# Altium project v2.1.PrjPCB
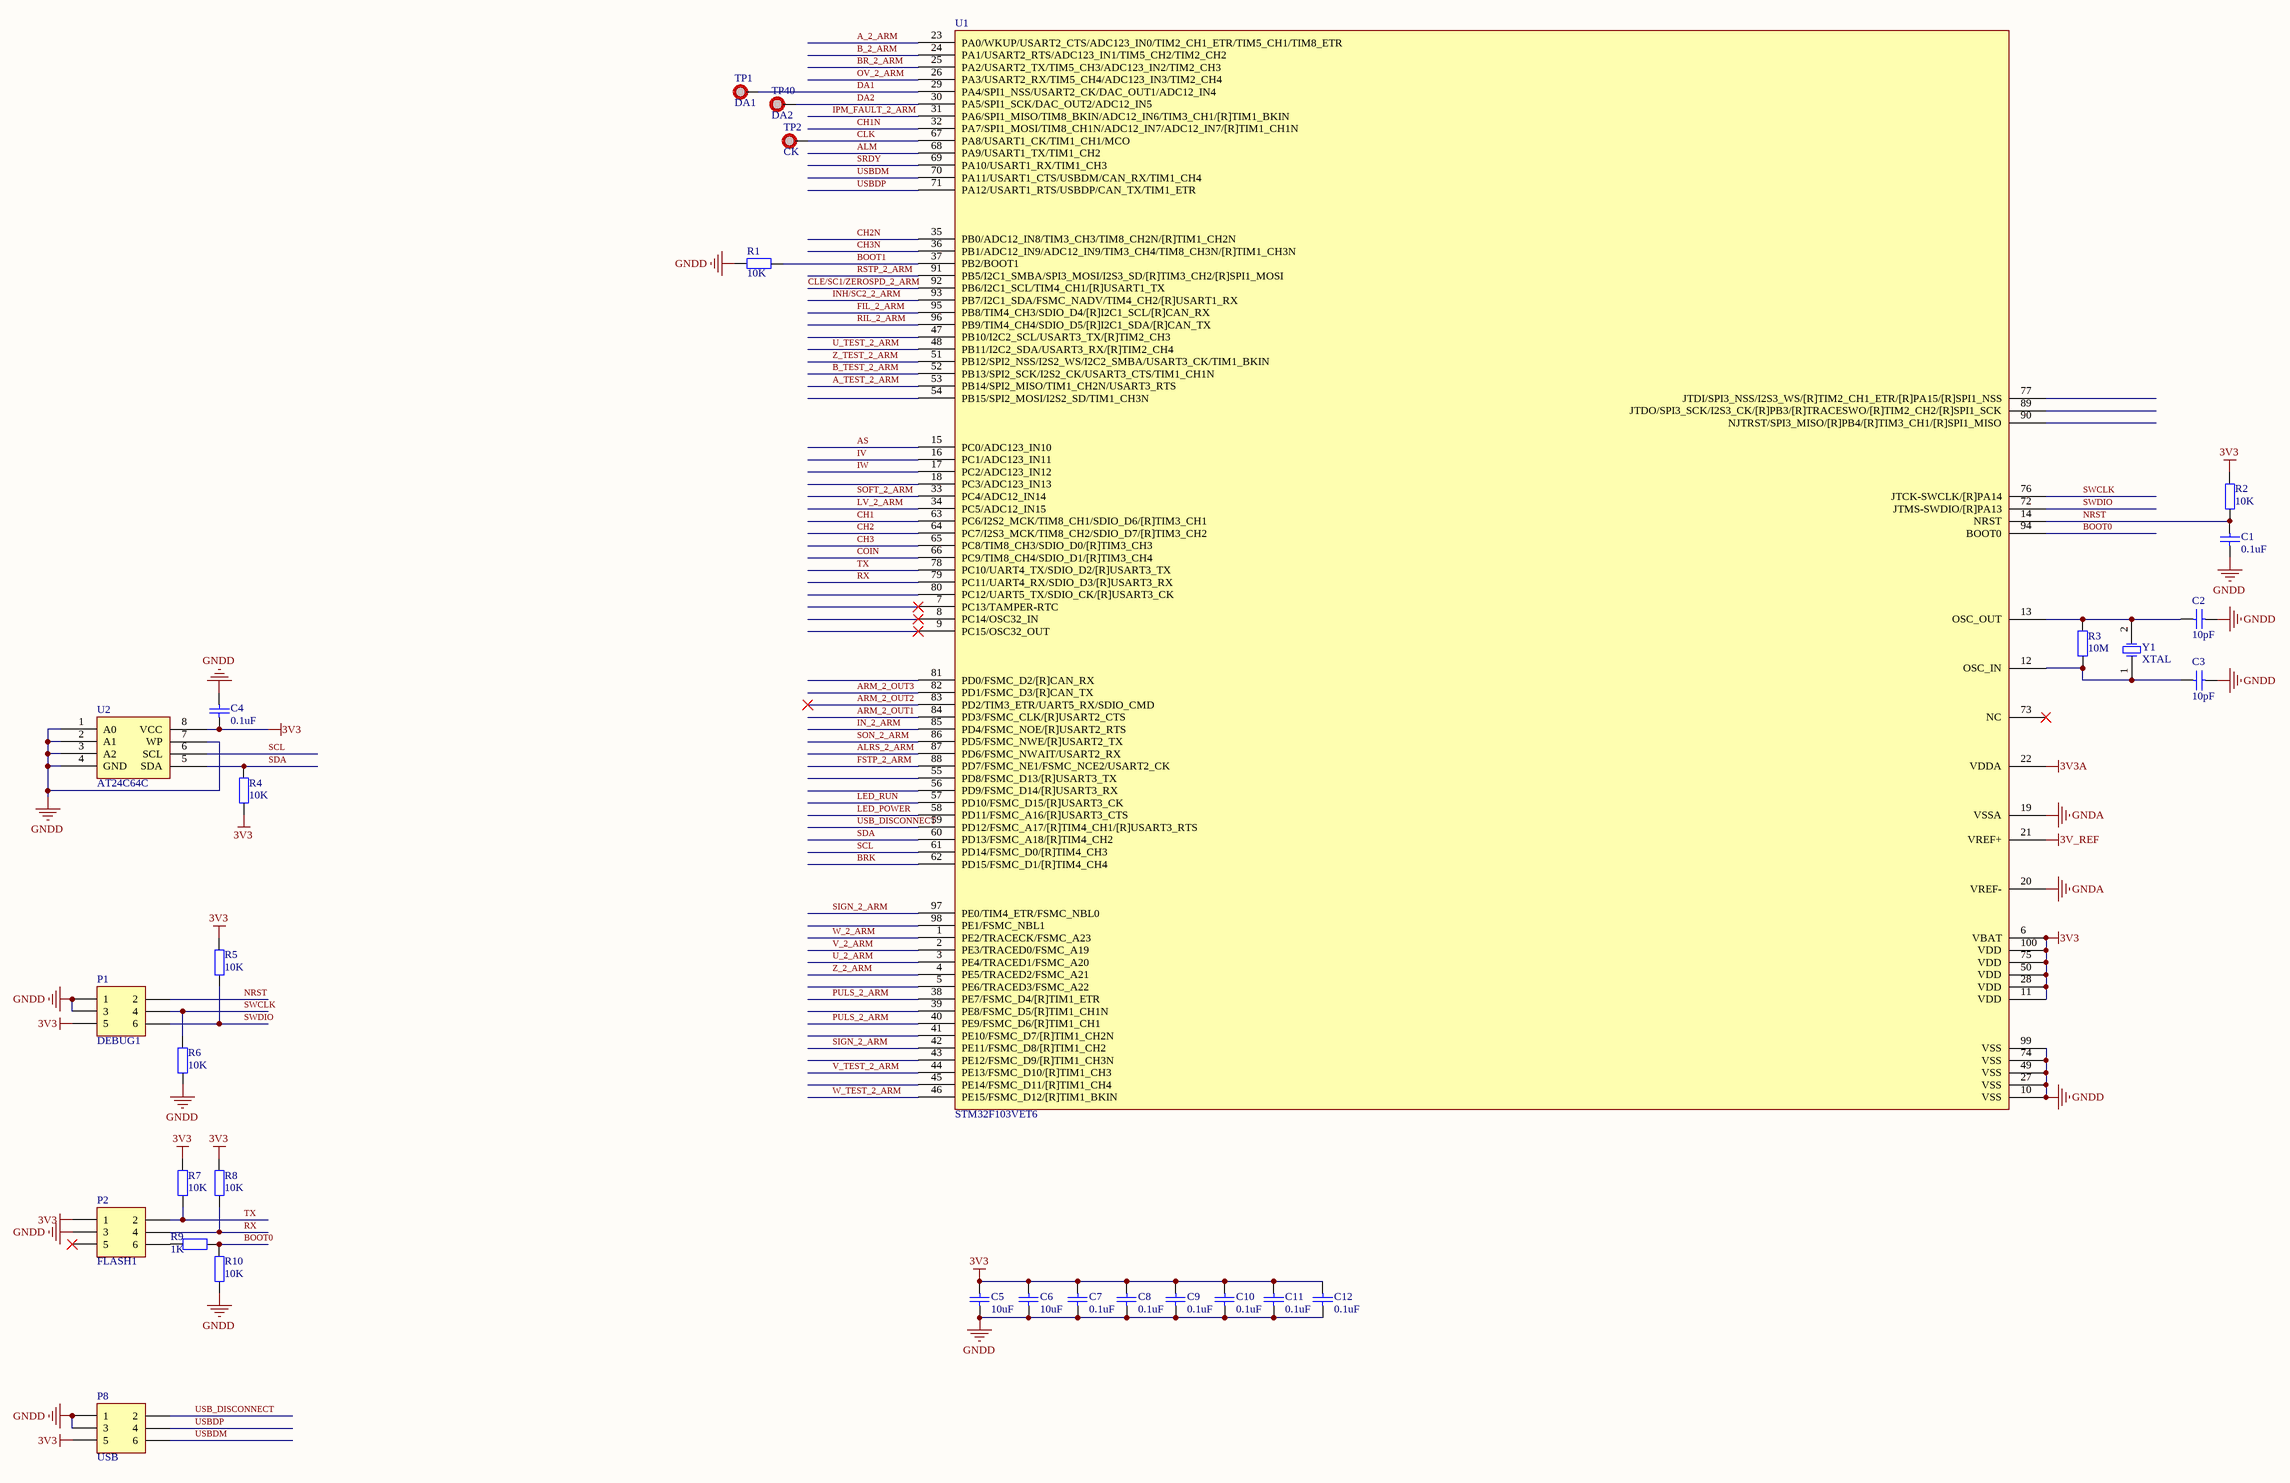
[diagram p0: MCU.SchDoc]
6 sheets, 388 parts. Net scope: global (net labels, ports and power ports of the same name join across sheets).
Board file: V2.1.PcbDoc
Sheets:
  MCU.SchDoc
  调理电路.SchDoc
  指令.SchDoc
  编码器.SchDoc
  接口.SchDoc
  电源.SchDoc

## Sheet MCU.SchDoc
size A2

### Parts
C1  0.1uF  [C SMD 0603]
C2  10pF  [C SMD 0603]
C3  10pF  [C SMD 0603]
C4  0.1uF  [C SMD 0603]
C5  10uF  [C SMD 1206]
C6  10uF  [C SMD 1206]
C7  0.1uF  [C SMD 0603]
C8  0.1uF  [C SMD 0603]
C9  0.1uF  [C SMD 0603]
C10  0.1uF  [C SMD 0603]
C11  0.1uF  [C SMD 0603]
C12  0.1uF  [C SMD 0603]
P1  DEBUG1  [2.54 针 3*2]
P2  FLASH1  [2.54 针 3*2]
P8  USB  [2.54 针 3*2]
R1  10K  [R SMD 0603]
R2  10K  [R SMD 0603]
R3  10M  [R SMD 0603]
R4  10K  [R SMD 0603]
R5  10K  [R SMD 0603]
R6  10K  [R SMD 0603]
R7  10K  [R SMD 0603]
R8  10K  [R SMD 0603]
R9  1K  [R SMD 0603]
R10  10K  [R SMD 0603]
TP1  DA1  [测点]
TP2  CK  [测点]
TP40  DA2  [测点]
U1  STM32F103VET6  [LQFP100_L]
U2  AT24C64C  [TSSOP8]
Y1  XTAL  [XTAL]

### Nets
3V3: C4.2 C5.1 C6.1 C7.1 C8.1 C9.1 C10.1 C11.1 C12.1 P1.5 P2.1 P8.5 R2.2 R4.2 R5.2 R7.2 R8.2 U1.6(VBAT) U1.11(VDD) U1.28(VDD) U1.50(VDD) U1.75(VDD) U1.100(VDD) U2.8(VCC)
3V3A: U1.22(VDDA)
3V_REF: U1.21(VREF+)
GNDA: U1.19(VSSA) U1.20(VREF-)
GNDD: C1.2 C2.2 C3.2 C4.1 C5.2 C6.2 C7.2 C8.2 C9.2 C10.2 C11.2 C12.2 P1.1 P1.3 P2.3 P8.1 P8.3 R1.2 R6.1 R10.2 U1.10(VSS) U1.27(VSS) U1.49(VSS) U1.74(VSS) U1.99(VSS) U2.1(A0) U2.2(A1) U2.3(A2) U2.4(GND) U2.7(WP)
A_2_ARM: U1.23(PA0/WKUP/USART2_CTS/ADC123_IN0/TIM2_CH1_ETR/TIM5_CH1/TIM8_ETR)
A_TEST_2_ARM: U1.53(PB14/SPI2_MISO/TIM1_CH2N/USART3_RTS)
ALM: U1.68(PA9/USART1_TX/TIM1_CH2)
ALRS_2_ARM: U1.87(PD6/FSMC_NWAIT/USART2_RX)
ARM_2_OUT1: U1.84(PD3/FSMC_CLK/[R]USART2_CTS)
ARM_2_OUT2: U1.83(PD2/TIM3_ETR/UART5_RX/SDIO_CMD)
ARM_2_OUT3: U1.82(PD1/FSMC_D3/[R]CAN_TX)
AS: U1.15(PC0/ADC123_IN10)
B_2_ARM: U1.24(PA1/USART2_RTS/ADC123_IN1/TIM5_CH2/TIM2_CH2)
B_TEST_2_ARM: U1.52(PB13/SPI2_SCK/I2S2_CK/USART3_CTS/TIM1_CH1N)
BOOT0: R9.1 R10.1 U1.94(BOOT0)
BOOT1: R1.1 U1.37(PB2/BOOT1)
BR_2_ARM: U1.25(PA2/USART2_TX/TIM5_CH3/ADC123_IN2/TIM2_CH3)
BRK: U1.62(PD15/FSMC_D1/[R]TIM4_CH4)
CH1: U1.63(PC6/I2S2_MCK/TIM8_CH1/SDIO_D6/[R]TIM3_CH1)
CH1N: U1.32(PA7/SPI1_MOSI/TIM8_CH1N/ADC12_IN7/ADC12_IN7/[R]TIM1_CH1N)
CH2: U1.64(PC7/I2S3_MCK/TIM8_CH2/SDIO_D7/[R]TIM3_CH2)
CH2N: U1.35(PB0/ADC12_IN8/TIM3_CH3/TIM8_CH2N/[R]TIM1_CH2N)
CH3: U1.65(PC8/TIM8_CH3/SDIO_D0/[R]TIM3_CH3)
CH3N: U1.36(PB1/ADC12_IN9/ADC12_IN9/TIM3_CH4/TIM8_CH3N/[R]TIM1_CH3N)
CLE/SC1/ZEROSPD_2_ARM: U1.92(PB6/I2C1_SCL/TIM4_CH1/[R]USART1_TX)
CLK: TP2.1 U1.67(PA8/USART1_CK/TIM1_CH1/MCO)
COIN: U1.66(PC9/TIM8_CH4/SDIO_D1/[R]TIM3_CH4)
DA1: TP1.1 U1.29(PA4/SPI1_NSS/USART2_CK/DAC_OUT1/ADC12_IN4)
DA2: TP40.1 U1.30(PA5/SPI1_SCK/DAC_OUT2/ADC12_IN5)
FIL_2_ARM: U1.95(PB8/TIM4_CH3/SDIO_D4/[R]I2C1_SCL/[R]CAN_RX)
FSTP_2_ARM: U1.88(PD7/FSMC_NE1/FSMC_NCE2/USART2_CK)
IN_2_ARM: U1.85(PD4/FSMC_NOE/[R]USART2_RTS)
INH/SC2_2_ARM: U1.93(PB7/I2C1_SDA/FSMC_NADV/TIM4_CH2/[R]USART1_RX)
IPM_FAULT_2_ARM: U1.31(PA6/SPI1_MISO/TIM8_BKIN/ADC12_IN6/TIM3_CH1/[R]TIM1_BKIN)
IV: U1.16(PC1/ADC123_IN11)
IW: U1.17(PC2/ADC123_IN12)
LED_POWER: U1.58(PD11/FSMC_A16/[R]USART3_CTS)
LED_RUN: U1.57(PD10/FSMC_D15/[R]USART3_CK)
LV_2_ARM: U1.34(PC5/ADC12_IN15)
NRST: C1.1 P1.2 R2.1 U1.14(NRST)
OV_2_ARM: U1.26(PA3/USART2_RX/TIM5_CH4/ADC123_IN3/TIM2_CH4)
PULS_2_ARM: U1.38(PE7/FSMC_D4/[R]TIM1_ETR) U1.40(PE9/FSMC_D6/[R]TIM1_CH1)
RIL_2_ARM: U1.96(PB9/TIM4_CH4/SDIO_D5/[R]I2C1_SDA/[R]CAN_TX)
RSTP_2_ARM: U1.91(PB5/I2C1_SMBA/SPI3_MOSI/I2S3_SD/[R]TIM3_CH2/[R]SPI1_MOSI)
RX: P2.4 R8.1 U1.79(PC11/UART4_RX/SDIO_D3/[R]USART3_RX)
SCL: U1.61(PD14/FSMC_D0/[R]TIM4_CH3) U2.6(SCL)
SDA: R4.1 U1.60(PD13/FSMC_A18/[R]TIM4_CH2) U2.5(SDA)
SIGN_2_ARM: U1.42(PE11/FSMC_D8/[R]TIM1_CH2) U1.97(PE0/TIM4_ETR/FSMC_NBL0)
SOFT_2_ARM: U1.33(PC4/ADC12_IN14)
SON_2_ARM: U1.86(PD5/FSMC_NWE/[R]USART2_TX)
SRDY: U1.69(PA10/USART1_RX/TIM1_CH3)
SWCLK: P1.4 R6.2 U1.76(JTCK-SWCLK/[R]PA14)
SWDIO: P1.6 R5.1 U1.72(JTMS-SWDIO/[R]PA13)
TX: P2.2 R7.1 U1.78(PC10/UART4_TX/SDIO_D2/[R]USART3_TX)
U_2_ARM: U1.3(PE4/TRACED1/FSMC_A20)
U_TEST_2_ARM: U1.48(PB11/I2C2_SDA/USART3_RX/[R]TIM2_CH4)
USB_DISCONNECT: P8.2 U1.59(PD12/FSMC_A17/[R]TIM4_CH1/[R]USART3_RTS)
USBDM: P8.6 U1.70(PA11/USART1_CTS/USBDM/CAN_RX/TIM1_CH4)
USBDP: P8.4 U1.71(PA12/USART1_RTS/USBDP/CAN_TX/TIM1_ETR)
V_2_ARM: U1.2(PE3/TRACED0/FSMC_A19)
V_TEST_2_ARM: U1.44(PE13/FSMC_D10/[R]TIM1_CH3)
W_2_ARM: U1.1(PE2/TRACECK/FSMC_A23)
W_TEST_2_ARM: U1.46(PE15/FSMC_D12/[R]TIM1_BKIN)
Z_2_ARM: U1.4(PE5/TRACED2/FSMC_A21)
Z_TEST_2_ARM: U1.51(PB12/SPI2_NSS/I2S2_WS/I2C2_SMBA/USART3_CK/TIM1_BKIN)
NetC2_1: C2.1 R3.1 U1.13(OSC_OUT) Y1.2(OSC2)
NetC3_1: C3.1 R3.2 U1.12(OSC_IN) Y1.1(OSC1)
NetP2_6: P2.6 R9.2

Not connected (* = marked no-connect by the designer): P2 5*; U1 5(PE6/TRACED3/FSMC_A22) 7(PC13/TAMPER-RTC)* 8(PC14/OSC32_IN)* 9(PC15/OSC32_OUT)* 18(PC3/ADC123_IN13) 39(PE8/FSMC_D5/[R]TIM1_CH1N) 41(PE10/FSMC_D7/[R]TIM1_CH2N) 43(PE12/FSMC_D9/[R]TIM1_CH3N) 45(PE14/FSMC_D11/[R]TIM1_CH4) 47(PB10/I2C2_SCL/USART3_TX/[R]TIM2_CH3) 54(PB15/SPI2_MOSI/I2S2_SD/TIM1_CH3N) 55(PD8/FSMC_D13/[R]USART3_TX) 56(PD9/FSMC_D14/[R]USART3_RX) 73(NC)* 77(JTDI/SPI3_NSS/I2S3_WS/[R]TIM2_CH1_ETR/[R]PA15/[R]SPI1_NSS) 80(PC12/UART5_TX/SDIO_CK/[R]USART3_CK) 81(PD0/FSMC_D2/[R]CAN_RX) 89(JTDO/SPI3_SCK/I2S3_CK/[R]PB3/[R]TRACESWO/[R]TIM2_CH2/[R]SPI1_SCK) 90(NJTRST/SPI3_MISO/[R]PB4/[R]TIM3_CH1/[R]SPI1_MISO) 98(PE1/FSMC_NBL1)

### Library data of the parts
C1 C4 C7-C12 = Cap: Capacitor; Published: 8-Jun-2000; LatestRevisionDate: 17-Jul-2002; LatestRevisionNote: Re-released for DXP Platform.; PackageReference: RAD-0.3; Publisher: Altium Limited; Value: 0.1uF
  C1 C7-C12: PackageDescription: Radial Cap, Thru-Hole; 2 Leads; 0.3 in Pin Spacing
C2 C3 C5 C6 = Cap: Capacitor; Value: 0.1uF; Published: 8-Jun-2000; LatestRevisionDate: 17-Jul-2002; LatestRevisionNote: Re-released for DXP Platform.; PackageReference: RAD-0.3; Publisher: Altium Limited; PackageDescription: Radial Cap, Thru-Hole; 2 Leads; 0.3 in Pin Spacing
P1 P2 P8 = Header 3X2: Header, 3-Pin, Dual row; LatestRevisionDate: 17-Jul-2002; LatestRevisionNote: Re-released for DXP Platform.; Publisher: Altium Limited
R1-R3 R5-R10 = Res2: Resistor; Value: 1M; Published: 8-Jun-2000; LatestRevisionDate: 17-Jul-2002; LatestRevisionNote: Re-released for DXP Platform.; PackageReference: AXIAL-0.4; Publisher: Altium Limited
R4 = Res2: Resistor; Published: 8-Jun-2000; LatestRevisionDate: 17-Jul-2002; LatestRevisionNote: Re-released for DXP Platform.; PackageReference: AXIAL-0.4; Publisher: Altium Limited; Value: 10K
TP1 TP2 TP40 = TEST_POINT
Y1 = XTAL: Crystal Oscillator; Published: 8-Jun-2000; LatestRevisionDate: 17-Jul-2002; LatestRevisionNote: Re-released for DXP Platform.; PackageReference: R38; Publisher: Altium Limited

## Sheet 调理电路.SchDoc
size A4 portrait
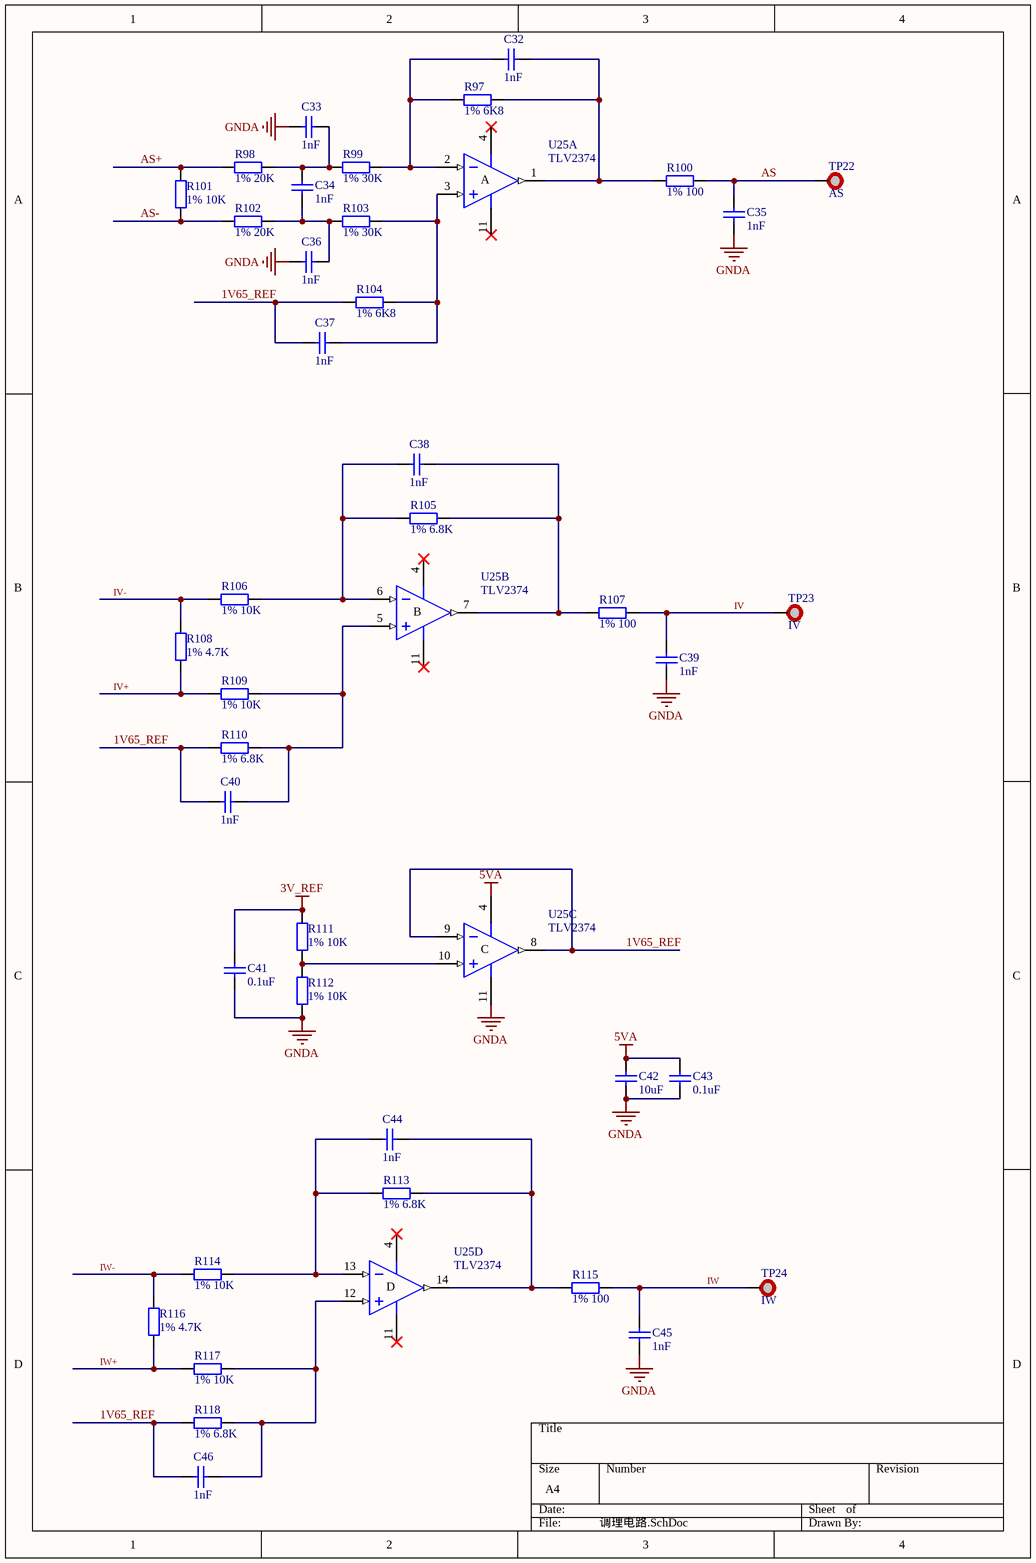
[diagram p1: 调理电路.SchDoc]

### Parts
C32  1nF  [C SMD 0603]
C33  1nF  [C SMD 0603]
C34  1nF  [C SMD 0603]
C35  1nF  [C SMD 0603]
C36  1nF  [C SMD 0603]
C37  1nF  [C SMD 0603]
C38  1nF  [C SMD 0603]
C39  1nF  [C SMD 0603]
C40  1nF  [C SMD 0603]
C41  0.1uF  [C SMD 0603]
C42  10uF  [C SMD 1206]
C43  0.1uF  [C SMD 0603]
C44  1nF  [C SMD 0603]
C45  1nF  [C SMD 0603]
C46  1nF  [C SMD 0603]
R97  1% 6K8  [R SMD 0603 1%]
R98  1% 20K  [R SMD 0603 1%]
R99  1% 30K  [R SMD 0603 1%]
R100  1% 100  [R SMD 0603 1%]
R101  1% 10K  [R SMD 0603 1%]
R102  1% 20K  [R SMD 0603 1%]
R103  1% 30K  [R SMD 0603 1%]
R104  1% 6K8  [R SMD 0603 1%]
R105  1% 6.8K  [R SMD 0603 1%]
R106  1% 10K  [R SMD 0603 1%]
R107  1% 100  [R SMD 0603 1%]
R108  1% 4.7K  [R SMD 0603 1%]
R109  1% 10K  [R SMD 0603 1%]
R110  1% 6.8K  [R SMD 0603 1%]
R111  1% 10K  [R SMD 0603 1%]
R112  1% 10K  [R SMD 0603 1%]
R113  1% 6.8K  [R SMD 0603 1%]
R114  1% 10K  [R SMD 0603 1%]
R115  1% 100  [R SMD 0603 1%]
R116  1% 4.7K  [R SMD 0603 1%]
R117  1% 10K  [R SMD 0603 1%]
R118  1% 6.8K  [R SMD 0603 1%]
TP22  AS  [测点]
TP23  IV  [测点]
TP24  IW  [测点]
U25  TLV2374  [NSO14_N]  (parts A,B,C,D of 4)

### Nets
3V_REF: C41.2 R111.2
5VA: C42.2 C43.2 U25.4(V+)
GNDA: C33.1 C35.1 C36.1 C39.1 C41.1 C42.1 C43.1 C45.1 R112.1 U25.11(V-)
1V65_REF: C37.1 C40.1 C46.1 R104.1 R110.2 R118.2 U25.8(OUT) U25.9(IN-)
AS: C35.2 R100.2 TP22.1
AS+: R98.1 R101.1
AS-: R101.2 R102.1
IV: C39.2 R107.2 TP23.1
IV+: R108.2 R109.2
IV-: R106.2 R108.1
IW: C45.2 R115.2 TP24.1
IW+: R116.2 R117.2
IW-: R114.2 R116.1
NetC32_1: C32.1 R97.1 R99.2 U25.2(IN-)
NetC32_2: C32.2 R97.2 R100.1 U25.1(OUT)
NetC33_2: C33.2 C34.1 R98.2 R99.1
NetC34_2: C34.2 C36.2 R102.2 R103.1
NetC37_2: C37.2 R103.2 R104.2 U25.3(IN+)
NetC38_1: C38.1 R105.2 R106.1 U25.6(IN-)
NetC38_2: C38.2 R105.1 R107.1 U25.7(OUT)
NetC40_2: C40.2 R109.1 R110.1 U25.5(IN+)
NetC44_1: C44.1 R113.2 R114.1 U25.13(IN-)
NetC44_2: C44.2 R113.1 R115.1 U25.14(OUT)
NetC46_2: C46.2 R117.1 R118.1 U25.12(IN+)
NetR111_1: R111.1 R112.2 U25.10(IN+)

### Notes on the sheet
- (in symbol OPA4130PA, part A) A
- (in symbol OPA4130PA, part B) B
- (in symbol OPA4130PA, part C) C
- (in symbol OPA4130PA, part D) D

### Library data of the parts
C32-C40 C44-C46 = Cap: Capacitor; Value: 0.1uF; Published: 8-Jun-2000; LatestRevisionDate: 17-Jul-2002; LatestRevisionNote: Re-released for DXP Platform.; PackageReference: RAD-0.3; Publisher: Altium Limited; PackageDescription: Radial Cap, Thru-Hole; 2 Leads; 0.3 in Pin Spacing
C41-C43 = Cap: Capacitor; Value: 104; Published: 8-Jun-2000; LatestRevisionDate: 17-Jul-2002; LatestRevisionNote: Re-released for DXP Platform.; PackageReference: RAD-0.3; Publisher: Altium Limited
R97-R118 = Res2: Resistor; Value: 1K; Published: 8-Jun-2000; LatestRevisionDate: 17-Jul-2002; LatestRevisionNote: Re-released for DXP Platform.; PackageReference: AXIAL-0.4; Publisher: Altium Limited
TP22-TP24 = TEST_POINT
U25 = OPA4130PA: Low-Power, Precision FET-Input Operational Amplifiers; Published: 8-Jun-2000; LatestRevisionDate: 06-Jun-2005; LatestRevisionNote: Stylized 3D Model Added.; DatasheetVersion: May-1998; PackageVersion: 1996/1997; PackageReference: 010G; Publisher: Altium Limited; PackageDescription: DIP; 14 Leads; Row Spacing 7.62 mm; Pitch 2.54 mm; ComponentLink1Description: Manufacturer Link; ComponentLink1URL: http://www.ti.com/; ComponentLink2Description: Datasheet; ComponentLink2URL: http://www-s.ti.com/sc/ds/OPA130.pdf

## Sheet 指令.SchDoc
size A1 portrait
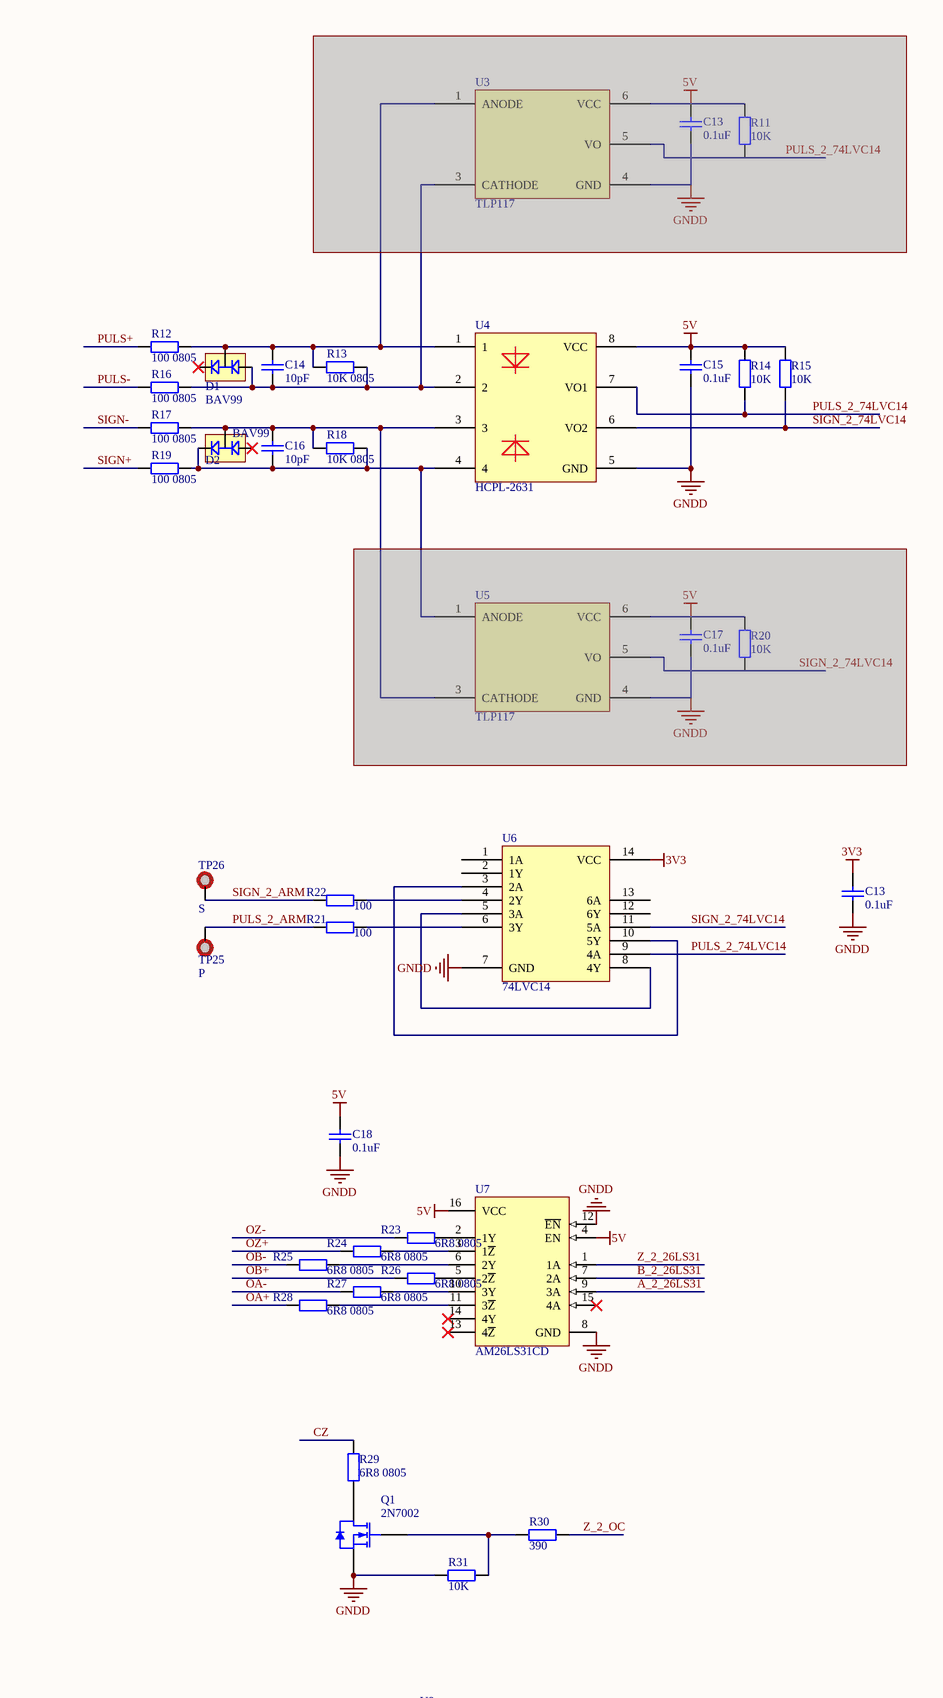
[diagram p2: 指令.SchDoc, top]
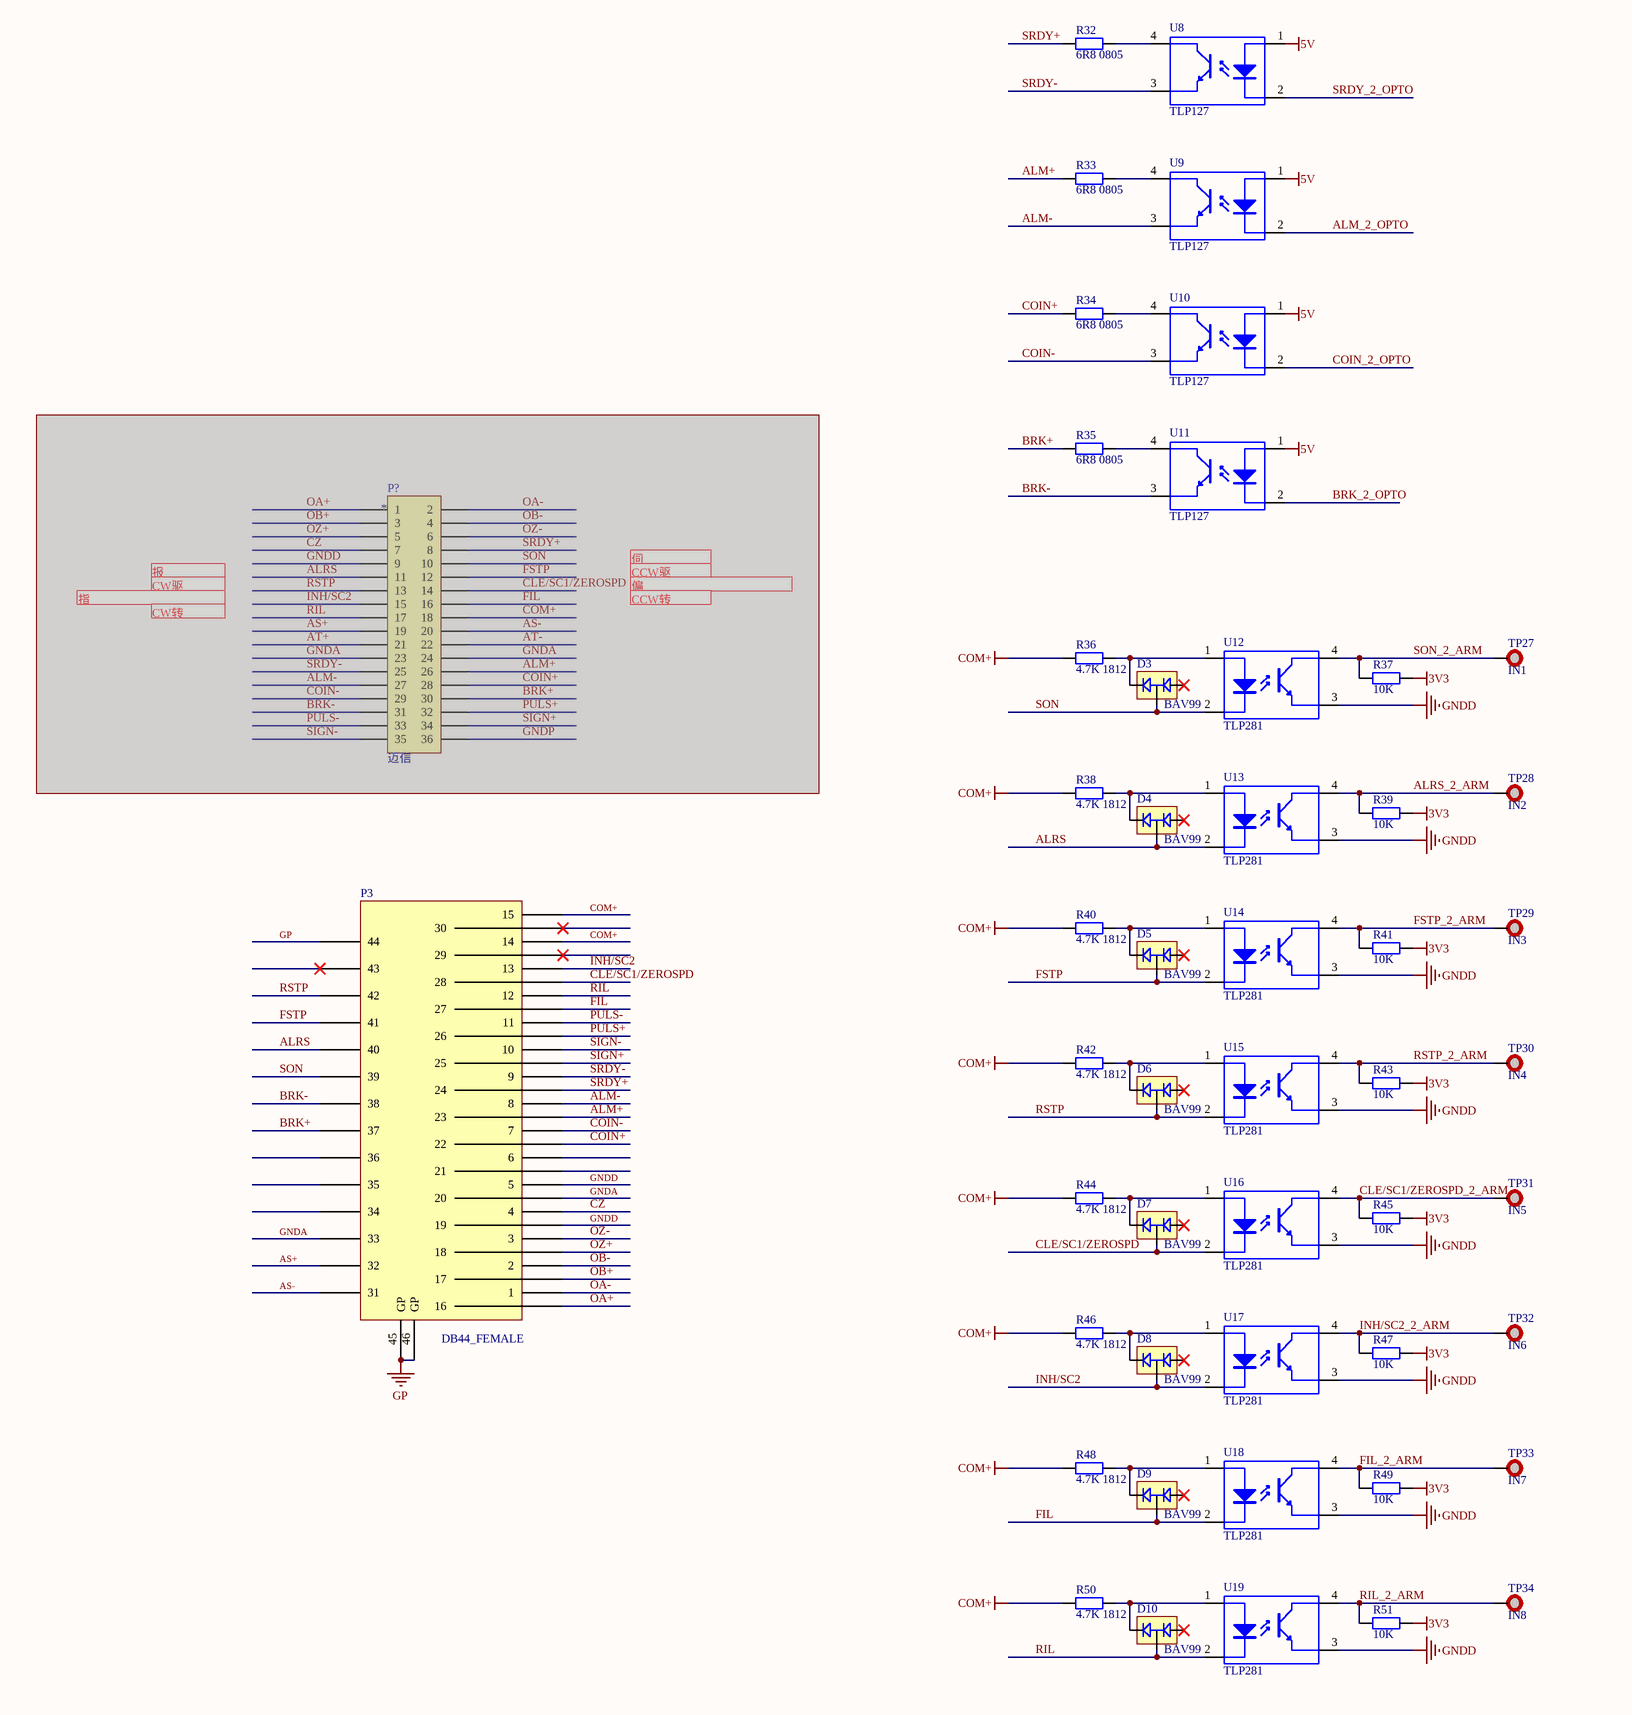
[diagram p3: 指令.SchDoc, bottom]

### Parts
(Parts that share a designator on the sheet are numbered #1, #2 ... from top to bottom, then left to right.)
C13#1  0.1uF  [C SMD 0603]  (masked out: inside a compile mask, not in the netlist)
C13#2  0.1uF  [C SMD 0603]
C14  10pF  [C SMD 0603]
C15  0.1uF  [C SMD 0603]
C16  10pF  [C SMD 0603]
C17#1  0.1uF  [C SMD 0603]  (masked out: inside a compile mask, not in the netlist)
C18  0.1uF  [C SMD 0603]
D1  BAV99  [SOT23]
D2  BAV99  [SOT23]
D3  BAV99  [SOT23]
D4  BAV99  [SOT23]
D5  BAV99  [SOT23]
D6  BAV99  [SOT23]
D7  BAV99  [SOT23]
D8  BAV99  [SOT23]
D9  BAV99  [SOT23]
D10  BAV99  [SOT23]
P3  DB44_FEMALE
P?#1  *  [AMP36_小孔小焊盘]  (masked out: inside a compile mask, not in the netlist)
Q1  2N7002  [SOT23]
R11#1  10K  [R SMD 0603]  (masked out: inside a compile mask, not in the netlist)
R12  100 0805  [R SMD 0805]
R13  10K 0805  [R SMD 0805]
R14  10K  [R SMD 0603]
R15  10K  [R SMD 0603]
R16  100 0805  [R SMD 0805]
R17  100 0805  [R SMD 0805]
R18  10K 0805  [R SMD 0805]
R19  100 0805  [R SMD 0805]
R20#1  10K  [R SMD 0603]  (masked out: inside a compile mask, not in the netlist)
R21  100  [R SMD 0603]
R22  100  [R SMD 0603]
R23  6R8 0805  [R SMD 0805]
R24  6R8 0805  [R SMD 0805]
R25  6R8 0805  [R SMD 0805]
R26  6R8 0805  [R SMD 0805]
R27  6R8 0805  [R SMD 0805]
R28  6R8 0805  [R SMD 0805]
R29  6R8 0805  [R SMD 0805]
R30  390  [R SMD 0603]
R31  10K  [R SMD 0603]
R32  6R8 0805  [R SMD 0805]
R33  6R8 0805  [R SMD 0805]
R34  6R8 0805  [R SMD 0805]
R35  6R8 0805  [R SMD 0805]
R36  4.7K 1812  [R SMD 1812]
R37  10K  [R SMD 0603]
R38  4.7K 1812  [R SMD 1812]
R39  10K  [R SMD 0603]
R40  4.7K 1812  [R SMD 1812]
R41  10K  [R SMD 0603]
R42  4.7K 1812  [R SMD 1812]
R43  10K  [R SMD 0603]
R44  4.7K 1812  [R SMD 1812]
R45  10K  [R SMD 0603]
R46  4.7K 1812  [R SMD 1812]
R47  10K  [R SMD 0603]
R48  4.7K 1812  [R SMD 1812]
R49  10K  [R SMD 0603]
R50  4.7K 1812  [R SMD 1812]
R51  10K  [R SMD 0603]
TP25  P  [测点]
TP26  S  [测点]
TP27  IN1  [测点]
TP28  IN2  [测点]
TP29  IN3  [测点]
TP30  IN4  [测点]
TP31  IN5  [测点]
TP32  IN6  [测点]
TP33  IN7  [测点]
TP34  IN8  [测点]
U3#1  TLP117  [TLP117]  (masked out: inside a compile mask, not in the netlist)
U4  HCPL-2631  [HCPL062N]
U5  TLP117  [TLP117]  (masked out: inside a compile mask, not in the netlist)
U6  74LVC14  [TSSOP14]
U7  AM26LS31CD  [NSO16_N]
U8  TLP127  [TLP181]
U9  TLP127  [TLP181]
U10  TLP127  [TLP181]
U11  TLP127  [TLP181]
U12  TLP281  [TLP281]
U13  TLP281  [TLP281]
U14  TLP281  [TLP281]
U15  TLP281  [TLP281]
U16  TLP281  [TLP281]
U17  TLP281  [TLP281]
U18  TLP281  [TLP281]
U19  TLP281  [TLP281]

### Nets
3V3: C13#2.1 R37.1 R39.1 R41.1 R43.1 R45.1 R47.1 R49.1 R51.1 U6.14(VCC)
5V: C15.2 C18.1 R14.2 R15.2 U4.8(VCC) U7.4(EN) U7.16(VCC) U8.1 U9.1 U10.1 U11.1
COM+: P3.14 P3.15 R36.2 R38.2 R40.2 R42.2 R44.2 R46.2 R48.2 R50.2
GNDA: P3.20 P3.33
GNDD: C13#2.2 C15.1 C18.2 P3.5 P3.19 Q1.2(S) R31.2 U4.5(GND) U6.7(GND) U7.8(GND) U7.12(~{EN}) U12.3 U13.3 U14.3 U15.3 U16.3 U17.3 U18.3 U19.3
GP: P3.44 P3.45(GP) P3.46(GP)
A_2_26LS31: U7.9(3A)
ALM+: P3.23 R33.2
ALM-: P3.8 U9.3
ALM_2_OPTO: U9.2
ALRS: D4.3 P3.40 U13.2
ALRS_2_ARM: R39.2 TP28.1 U13.4
AS+: P3.32
AS-: P3.31
B_2_26LS31: U7.7(2A)
BRK+: P3.37 R35.2
BRK-: P3.38 U11.3
BRK_2_OPTO: U11.2
CLE/SC1/ZEROSPD: D7.3 P3.28 U16.2
CLE/SC1/ZEROSPD_2_ARM: R45.2 TP31.1 U16.4
COIN+: P3.22 R34.2
COIN-: P3.7 U10.3
COIN_2_OPTO: U10.2
CZ: P3.4 R29.1
FIL: D9.3 P3.27 U18.2
FIL_2_ARM: R49.2 TP33.1 U18.4
FSTP: D5.3 P3.41 U14.2
FSTP_2_ARM: R41.2 TP29.1 U14.4
INH/SC2: D8.3 P3.13 U17.2
INH/SC2_2_ARM: R47.2 TP32.1 U17.4
OA+: P3.16 R28.2
OA-: P3.1 R27.2
OB+: P3.17 R26.2
OB-: P3.2 R25.2
OZ+: P3.18 R24.2
OZ-: P3.3 R23.2
PULS+: P3.26 R12.2
PULS-: P3.11 R16.2
PULS_2_74LVC14: R14.1 U4.7(VO1) U6.9(4A)
PULS_2_ARM: R21.1 TP25.1
RIL: D10.3 P3.12 U19.2
RIL_2_ARM: R51.2 TP34.1 U19.4
RSTP: D6.3 P3.42 U15.2
RSTP_2_ARM: R43.2 TP30.1 U15.4
SIGN+: P3.25 R19.2
SIGN-: P3.10 R17.2
SIGN_2_74LVC14: R15.1 U4.6(VO2) U6.11(5A)
SIGN_2_ARM: R22.1 TP26.1
SON: D3.3 P3.39 U12.2
SON_2_ARM: R37.2 TP27.1 U12.4
SRDY+: P3.24 R32.2
SRDY-: P3.9 U8.3
SRDY_2_OPTO: U8.2
Z_2_26LS31: U7.1(1A)
Z_2_OC: R30.2
NetC14_1: C14.1 D1.1 R13.1 R16.1 U4.2
NetC14_2: C14.2 D1.3 R12.1 R13.2 U4.1
NetC16_1: C16.1 D2.2 R18.1 R19.1 U4.4
NetC16_2: C16.2 D2.3 R17.1 R18.2 U4.3
NetD3_2: D3.2 R36.1 U12.1
NetD4_2: D4.2 R38.1 U13.1
NetD5_2: D5.2 R40.1 U14.1
NetD6_2: D6.2 R42.1 U15.1
NetD7_2: D7.2 R44.1 U16.1
NetD8_2: D8.2 R46.1 U17.1
NetD9_2: D9.2 R48.1 U18.1
NetD10_2: D10.2 R50.1 U19.1
NetQ1_1: Q1.1(G) R30.1 R31.1
NetQ1_3: Q1.3(D) R29.2
NetR21_2: R21.2 U6.6(3Y)
NetR22_2: R22.2 U6.4(2Y)
NetR23_1: R23.1 U7.2(1Y)
NetR24_1: R24.1 U7.3(1~{Z})
NetR25_1: R25.1 U7.6(2Y)
NetR26_1: R26.1 U7.5(2~{Z})
NetR27_1: R27.1 U7.10(3Y)
NetR28_1: R28.1 U7.11(3~{Z})
NetR32_1: R32.1 U8.4
NetR33_1: R33.1 U9.4
NetR34_1: R34.1 U10.4
NetR35_1: R35.1 U11.4
NetU6_3: U6.3(2A) U6.10(5Y)
NetU6_5: U6.5(3A) U6.8(4Y)

Not connected (* = marked no-connect by the designer): D1 2*; D2 1*; D3 1*; D4 1*; D5 1*; D6 1*; D7 1*; D8 1*; D9 1*; D10 1*; P3 6 21 29* 30* 34 35 36 43*; U6 1(1A) 2(1Y) 12(6Y) 13(6A); U7 13(4~{Z})* 14(4Y)* 15(4A)*

### Notes on the sheet
- 伺
- 指
- 报
- CW驱
- CW转
- CCW驱
- 偏
- CCW转
- (in symbol Header 18X2) 迈信

### Library data of the parts
C13#1 C15 C17#1 = Cap: Capacitor; Value: 104; Published: 8-Jun-2000; LatestRevisionDate: 17-Jul-2002; LatestRevisionNote: Re-released for DXP Platform.; PackageReference: RAD-0.3; Publisher: Altium Limited
C13#2 C18 = Cap: Capacitor; Published: 8-Jun-2000; LatestRevisionDate: 17-Jul-2002; LatestRevisionNote: Re-released for DXP Platform.; PackageReference: RAD-0.3; Publisher: Altium Limited; PackageDescription: Radial Cap, Thru-Hole; 2 Leads; 0.3 in Pin Spacing; Value: 0.1uF
C14 C16 = Cap: Capacitor; Value: 0.1uF; Published: 8-Jun-2000; LatestRevisionDate: 17-Jul-2002; LatestRevisionNote: Re-released for DXP Platform.; PackageReference: RAD-0.3; Publisher: Altium Limited; PackageDescription: Radial Cap, Thru-Hole; 2 Leads; 0.3 in Pin Spacing
P?#1 = Header 18X2: Header, 18-Pin, Dual row; LatestRevisionDate: 17-Jul-2002; LatestRevisionNote: Re-released for DXP Platform.; Publisher: Altium Limited
R11#1 R13-R15 R18 R20#1 R21 R22 R30 R31 R37 R39 R41 R43 R45 R47 R49 R51 = Res2: Resistor; Value: 3K; Published: 8-Jun-2000; LatestRevisionDate: 17-Jul-2002; LatestRevisionNote: Re-released for DXP Platform.; PackageReference: AXIAL-0.4; Publisher: Altium Limited
R12 R16 R17 R19 R23-R29 R32-R36 R38 R40 R42 R44 R46 R48 R50 = Res2: Resistor; Value: 1K2; Published: 8-Jun-2000; LatestRevisionDate: 17-Jul-2002; LatestRevisionNote: Re-released for DXP Platform.; PackageReference: AXIAL-0.4; Publisher: Altium Limited
TP25-TP34 = TEST_POINT
U4 = TLP521-2
U7 = AM26LS31CD: Quadruple Differential Line Driver; Published: 15-May-2002; LatestRevisionDate: 13-Apr-2006; LatestRevisionNote: IPC-7351 Footprint Added.; DatasheetVersion: May-1990; PackageVersion: Jan-1998; PackageReference: D016; Publisher: Altium Limited; PackageDescription: 16-Pin Small Outline Integrated Circuit 1.27 mm Pitch; Code_IPC: SOIC127P600-16; ComponentLink1Description: Manufacturer Link; ComponentLink1URL: http://www.ti.com/; ComponentLink2Description: Datasheet; ComponentLink2URL: http://www-s.ti.com/sc/ds/am26ls31.pdf
U8-U19 = TLP181/PC357

## Sheet 编码器.SchDoc
size A3
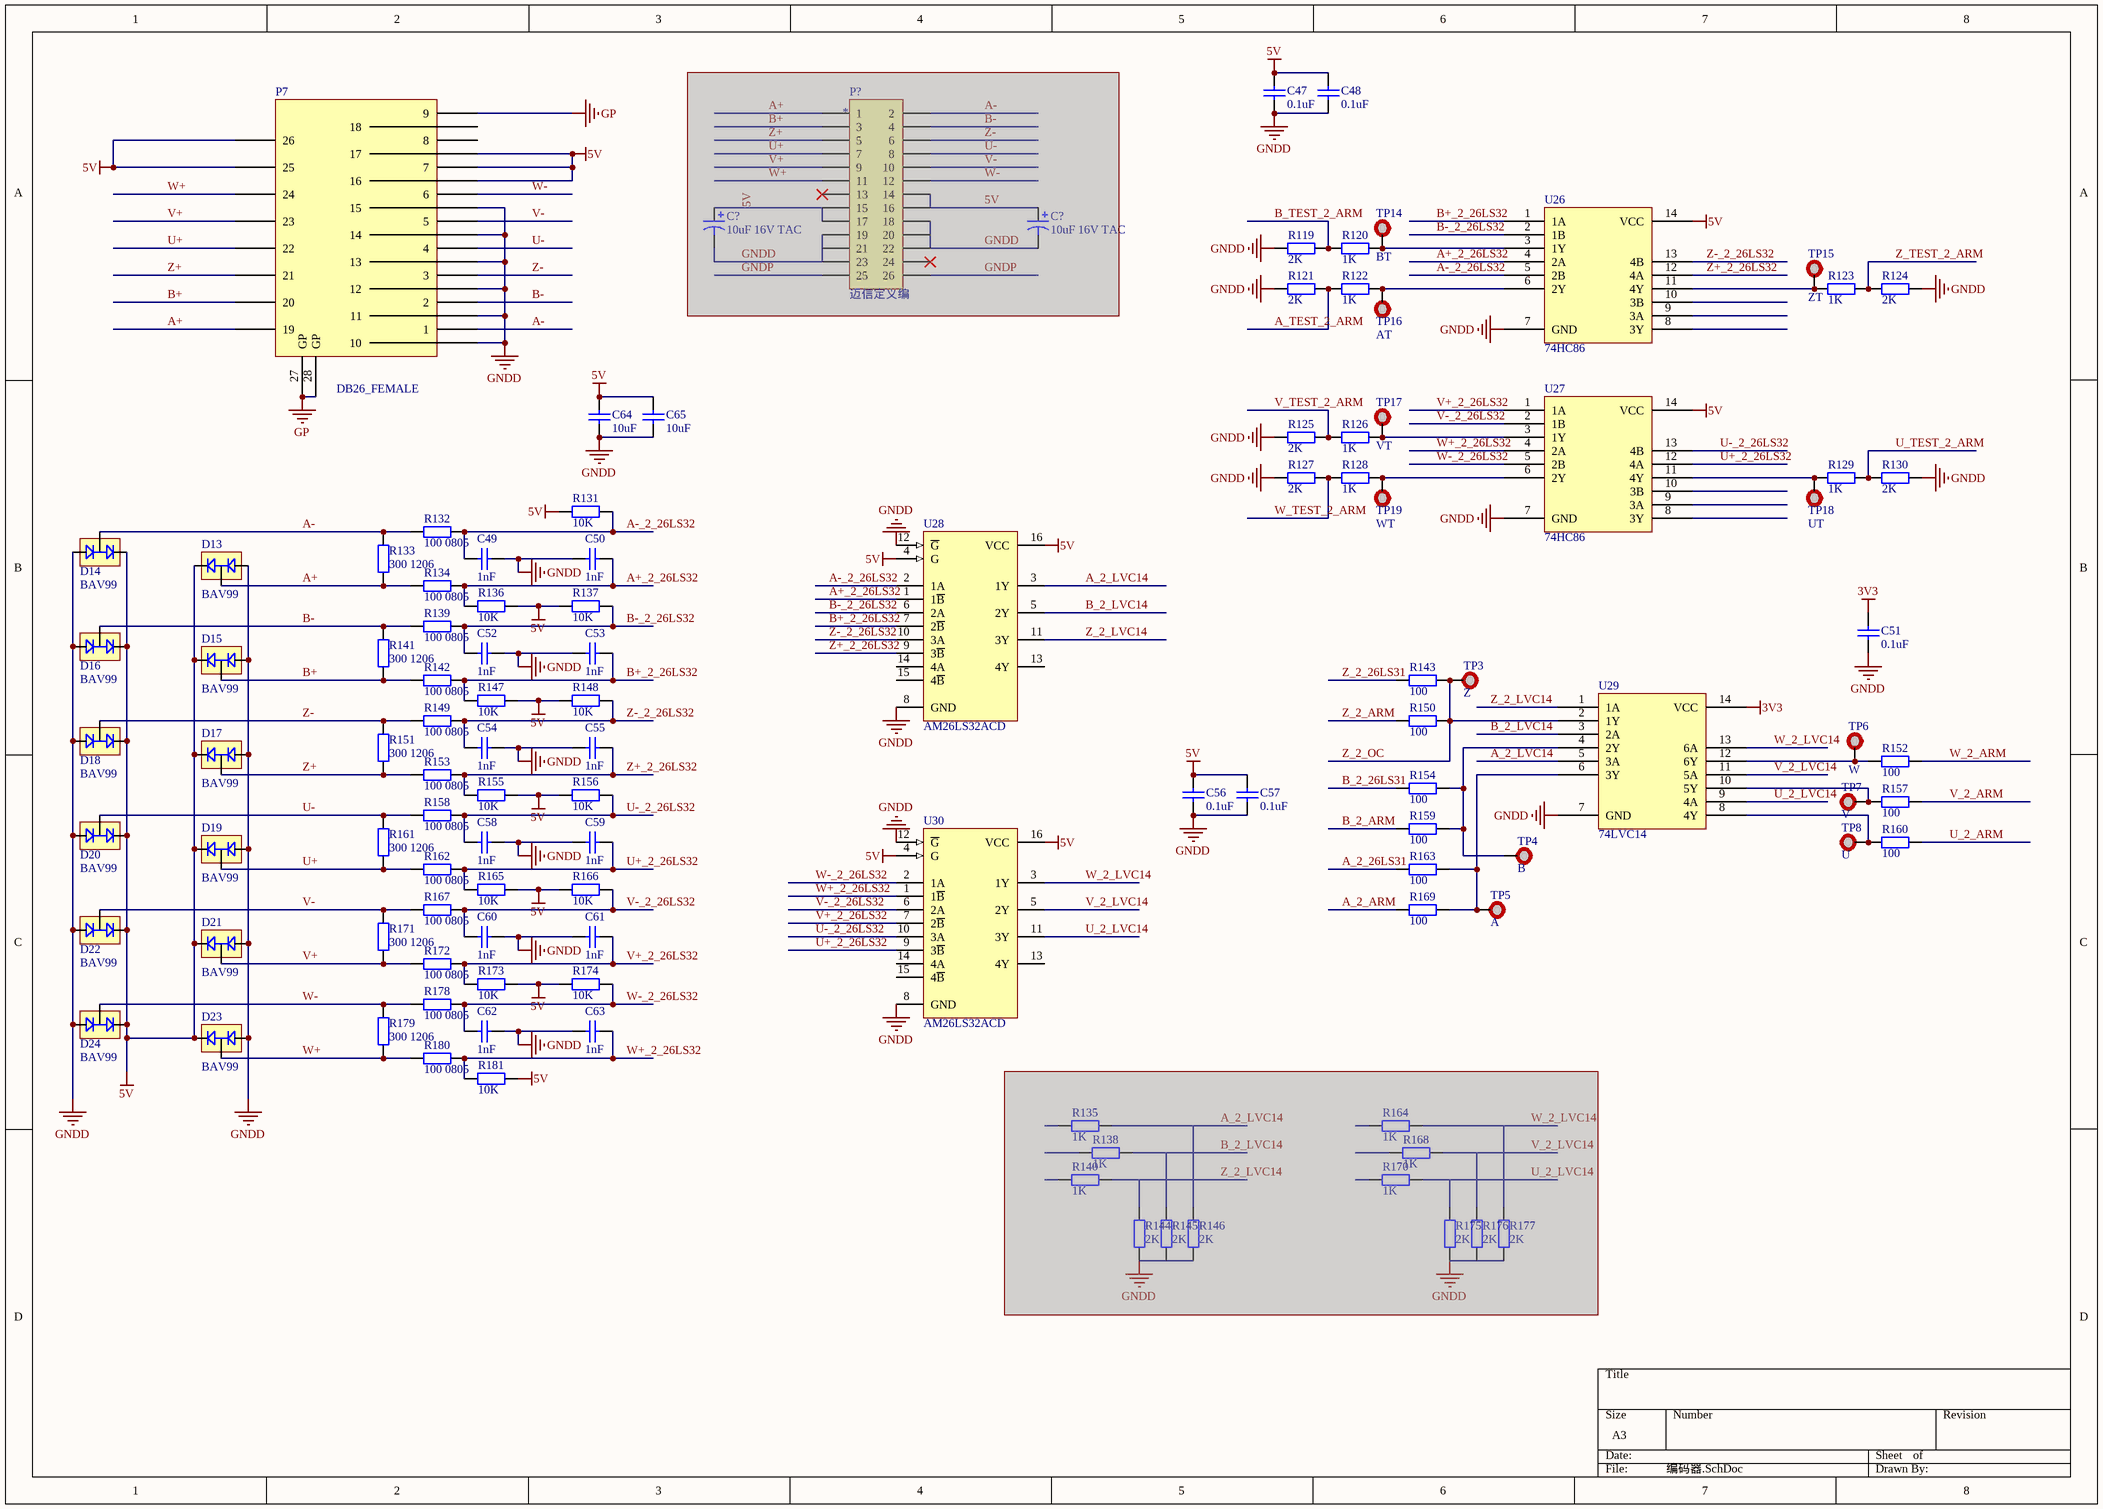
[diagram p4: 编码器.SchDoc]

### Parts
(Parts that share a designator on the sheet are numbered #1, #2 ... from top to bottom, then left to right.)
C47  0.1uF  [C SMD 0603]
C48  0.1uF  [C SMD 0603]
C49  1nF  [C SMD 0603]
C50  1nF  [C SMD 0603]
C51  0.1uF  [C SMD 0603]
C52  1nF  [C SMD 0603]
C53  1nF  [C SMD 0603]
C54  1nF  [C SMD 0603]
C55  1nF  [C SMD 0603]
C56  0.1uF  [C SMD 0603]
C57  0.1uF  [C SMD 0603]
C58  1nF  [C SMD 0603]
C59  1nF  [C SMD 0603]
C60  1nF  [C SMD 0603]
C61  1nF  [C SMD 0603]
C62  1nF  [C SMD 0603]
C63  1nF  [C SMD 0603]
C64  10uF  [C SMD 1206]
C65  10uF  [C SMD 1206]
C?#1  10uF 16V TAC  [3216TAC]  (masked out: inside a compile mask, not in the netlist)
C?#2  10uF 16V TAC  [3216TAC]  (masked out: inside a compile mask, not in the netlist)
D13  BAV99  [SOT23]
D14  BAV99  [SOT23]
D15  BAV99  [SOT23]
D16  BAV99  [SOT23]
D17  BAV99  [SOT23]
D18  BAV99  [SOT23]
D19  BAV99  [SOT23]
D20  BAV99  [SOT23]
D21  BAV99  [SOT23]
D22  BAV99  [SOT23]
D23  BAV99  [SOT23]
D24  BAV99  [SOT23]
P7  DB26_FEMALE
P?#2  *  [AMP26_小孔小焊盘]  (masked out: inside a compile mask, not in the netlist)
R119  2K  [R SMD 0603]
R120  1K  [R SMD 0603]
R121  2K  [R SMD 0603]
R122  1K  [R SMD 0603]
R123  1K  [R SMD 0603]
R124  2K  [R SMD 0603]
R125  2K  [R SMD 0603]
R126  1K  [R SMD 0603]
R127  2K  [R SMD 0603]
R128  1K  [R SMD 0603]
R129  1K  [R SMD 0603]
R130  2K  [R SMD 0603]
R131  10K  [R SMD 0603]
R132  100 0805  [R SMD 0805]
R133  300 1206  [R SMD 1206]
R134  100 0805  [R SMD 0805]
R135#1  1K  [R SMD 0603]  (masked out: inside a compile mask, not in the netlist)
R136  10K  [R SMD 0603]
R137  10K  [R SMD 0603]
R138#1  1K  [R SMD 0603]  (masked out: inside a compile mask, not in the netlist)
R139  100 0805  [R SMD 0805]
R140#1  1K  [R SMD 0603]  (masked out: inside a compile mask, not in the netlist)
R141  300 1206  [R SMD 1206]
R142  100 0805  [R SMD 0805]
R143  100  [R SMD 0603]
R144  2K  [R SMD 0603]  (masked out: inside a compile mask, not in the netlist)
R145  2K  [R SMD 0603]  (masked out: inside a compile mask, not in the netlist)
R146  2K  [R SMD 0603]  (masked out: inside a compile mask, not in the netlist)
R147  10K  [R SMD 0603]
R148  10K  [R SMD 0603]
R149  100 0805  [R SMD 0805]
R150  100  [R SMD 0603]
R151  300 1206  [R SMD 1206]
R152  100  [R SMD 0603]
R153  100 0805  [R SMD 0805]
R154  100  [R SMD 0603]
R155  10K  [R SMD 0603]
R156  10K  [R SMD 0603]
R157  100  [R SMD 0603]
R158  100 0805  [R SMD 0805]
R159  100  [R SMD 0603]
R160  100  [R SMD 0603]
R161  300 1206  [R SMD 1206]
R162  100 0805  [R SMD 0805]
R163  100  [R SMD 0603]
R164  1K  [R SMD 0603]  (masked out: inside a compile mask, not in the netlist)
R165  10K  [R SMD 0603]
R166  10K  [R SMD 0603]
R167  100 0805  [R SMD 0805]
R168  1K  [R SMD 0603]  (masked out: inside a compile mask, not in the netlist)
R169  100  [R SMD 0603]
R170  1K  [R SMD 0603]  (masked out: inside a compile mask, not in the netlist)
R171  300 1206  [R SMD 1206]
R172  100 0805  [R SMD 0805]
R173  10K  [R SMD 0603]
R174  10K  [R SMD 0603]
R175  2K  [R SMD 0603]  (masked out: inside a compile mask, not in the netlist)
R176  2K  [R SMD 0603]  (masked out: inside a compile mask, not in the netlist)
R177  2K  [R SMD 0603]  (masked out: inside a compile mask, not in the netlist)
R178  100 0805  [R SMD 0805]
R179  300 1206  [R SMD 1206]
R180  100 0805  [R SMD 0805]
R181  10K  [R SMD 0603]
TP3  Z  [测点]
TP4  B  [测点]
TP5  A  [测点]
TP6  W  [测点]
TP7  V  [测点]
TP8  U  [测点]
TP14  BT  [测点]
TP15  ZT  [测点]
TP16  AT  [测点]
TP17  VT  [测点]
TP18  UT  [测点]
TP19  WT  [测点]
U26  74HC86  [NSO14_N]
U27  74HC86  [NSO14_N]
U28  AM26LS32ACD  [NSO16_N]
U29  74LVC14  [TSSOP14]
U30  AM26LS32ACD  [NSO16_N]

### Nets
3V3: C51.1 U29.14(VCC)
5V: C47.1 C48.1 C56.1 C57.1 C64.1 C65.1 D13.2 D14.2 D15.2 D16.2 D17.2 D18.2 D19.2 D20.2 D21.2 D22.2 D23.2 D24.2 P7.7 P7.16 P7.17 P7.25 P7.26 R131.2 R136.2 R137.1 R147.2 R148.1 R155.2 R156.1 R165.2 R166.1 R173.2 R174.1 R181.2 U26.14(VCC) U27.14(VCC) U28.4(G) U28.16(VCC) U30.4(G) U30.16(VCC)
GNDD: C47.2 C48.2 C49.1 C50.2 C51.2 C52.1 C53.2 C54.1 C55.2 C56.2 C57.2 C58.1 C59.2 C60.1 C61.2 C62.1 C63.2 C64.2 C65.2 D13.1 D14.1 D15.1 D16.1 D17.1 D18.1 D19.1 D20.1 D21.1 D22.1 D23.1 D24.1 P7.10 P7.11 P7.12 P7.13 P7.14 P7.15 R119.2 R121.2 R124.2 R125.2 R127.2 R130.2 U26.7(GND) U27.7(GND) U28.8(GND) U28.12(~{G}) U29.7(GND) U30.8(GND) U30.12(~{G})
GP: P7.9 P7.27(GP) P7.28(GP)
A+: D13.3 P7.19 R133.2 R134.1
A+_2_26LS32: C50.1 R134.2 R136.1 U26.4(2A) U28.1(1~{B})
A-: D14.3 P7.1 R132.1 R133.1
A-_2_26LS32: C49.2 R131.1 R132.2 U26.5(2B) U28.2(1A)
A_2_26LS31: R163.1
A_2_ARM: R169.1
A_2_LVC14: U28.3(1Y) U29.5(3A)
A_TEST_2_ARM: R121.1 R122.2
B+: D15.3 P7.20 R141.2 R142.1
B+_2_26LS32: C53.1 R142.2 R147.1 U26.1(1A) U28.7(2~{B})
B-: D16.3 P7.2 R139.1 R141.1
B-_2_26LS32: C52.2 R137.2 R139.2 U26.2(1B) U28.6(2A)
B_2_26LS31: R154.1
B_2_ARM: R159.1
B_2_LVC14: U28.5(2Y) U29.3(2A)
B_TEST_2_ARM: R119.1 R120.2
U+: D19.3 P7.22 R161.2 R162.1
U+_2_26LS32: C59.1 R162.2 R165.1 U27.12(4A) U30.9(3~{B})
U-: D20.3 P7.4 R158.1 R161.1
U-_2_26LS32: C58.2 R156.2 R158.2 U27.13(4B) U30.10(3A)
U_2_ARM: R160.2
U_2_LVC14: U29.9(4A) U30.11(3Y)
U_TEST_2_ARM: R129.2 R130.1
V+: D21.3 P7.23 R171.2 R172.1
V+_2_26LS32: C61.1 R172.2 R173.1 U27.1(1A) U30.7(2~{B})
V-: D22.3 P7.5 R167.1 R171.1
V-_2_26LS32: C60.2 R166.2 R167.2 U27.2(1B) U30.6(2A)
V_2_ARM: R157.2
V_2_LVC14: U29.11(5A) U30.5(2Y)
V_TEST_2_ARM: R125.1 R126.2
W+: D23.3 P7.24 R179.2 R180.1
W+_2_26LS32: C63.1 R180.2 R181.1 U27.4(2A) U30.1(1~{B})
W-: D24.3 P7.6 R178.1 R179.1
W-_2_26LS32: C62.2 R174.2 R178.2 U27.5(2B) U30.2(1A)
W_2_ARM: R152.2
W_2_LVC14: U29.13(6A) U30.3(1Y)
W_TEST_2_ARM: R127.1 R128.2
Z+: D17.3 P7.21 R151.2 R153.1
Z+_2_26LS32: C55.1 R153.2 R155.1 U26.12(4A) U28.9(3~{B})
Z-: D18.3 P7.3 R149.1 R151.1
Z-_2_26LS32: C54.2 R148.2 R149.2 U26.13(4B) U28.10(3A)
Z_2_26LS31: R143.1
Z_2_ARM: R150.1
Z_2_LVC14: U28.11(3Y) U29.1(1A)
Z_2_OC: R143.2 R150.2 TP3.1 U29.2(1Y)
Z_TEST_2_ARM: R123.2 R124.1
NetR120_1: R120.1 TP14.1 U26.3(1Y)
NetR122_1: R122.1 TP16.1 U26.6(2Y)
NetR123_1: R123.1 TP15.1 U26.11(4Y)
NetR126_1: R126.1 TP17.1 U27.3(1Y)
NetR128_1: R128.1 TP19.1 U27.6(2Y)
NetR129_1: R129.1 TP18.1 U27.11(4Y)
NetR152_1: R152.1 TP6.1 U29.12(6Y)
NetR154_2: R154.2 R159.2 TP4.1 U29.4(2Y)
NetR157_1: R157.1 TP7.1 U29.10(5Y)
NetR160_1: R160.1 TP8.1 U29.8(4Y)
NetR163_2: R163.2 R169.2 TP5.1 U29.6(3Y)

Not connected (* = marked no-connect by the designer): P7 8 18; U26 8(3Y) 9(3A) 10(3B); U27 8(3Y) 9(3A) 10(3B); U28 13(4Y) 14(4A) 15(4~{B}); U30 13(4Y) 14(4A) 15(4~{B})

### Notes on the sheet
- (in symbol Header 13X2) 迈信定义编

### Library data of the parts
C47 C48 C51 C56 C57 = Cap: Capacitor; Published: 8-Jun-2000; LatestRevisionDate: 17-Jul-2002; LatestRevisionNote: Re-released for DXP Platform.; PackageReference: RAD-0.3; Publisher: Altium Limited; PackageDescription: Radial Cap, Thru-Hole; 2 Leads; 0.3 in Pin Spacing; Value: 0.1uF
C49 C50 C52-C55 C58-C65 = Cap: Capacitor; Value: 0.1uF; Published: 8-Jun-2000; LatestRevisionDate: 17-Jul-2002; LatestRevisionNote: Re-released for DXP Platform.; PackageReference: RAD-0.3; Publisher: Altium Limited; PackageDescription: Radial Cap, Thru-Hole; 2 Leads; 0.3 in Pin Spacing
C?#1 C?#2 = Cap Pol1: Polarized Capacitor (Radial); Value: 2.2uF; Published: 8-Jun-2000; LatestRevisionDate: 17-Jul-2002; LatestRevisionNote: Re-released for DXP Platform.; PackageReference: RB7.6-15; Publisher: Altium Limited; PackageDescription: Polarized Capacitor (Radial); 2 Leads
P?#2 = Header 13X2: Header, 13-Pin, Dual row; LatestRevisionDate: 17-Jul-2002; LatestRevisionNote: Re-released for DXP Platform.; Publisher: Altium Limited
R119-R134 R135#1 R136 R137 R138#1 R139 R140#1 R141 R142 R144-R149 R151 R153 R155 R156 R158 R161 R162 R164-R168 R170-R181 = Res2: Resistor; Value: Rx; Published: 8-Jun-2000; LatestRevisionDate: 17-Jul-2002; LatestRevisionNote: Re-released for DXP Platform.; PackageReference: AXIAL-0.4; Publisher: Altium Limited
R143 R150 R152 R154 R157 R159 R160 R163 R169 = Res2: Resistor; Value: 3K; Published: 8-Jun-2000; LatestRevisionDate: 17-Jul-2002; LatestRevisionNote: Re-released for DXP Platform.; PackageReference: AXIAL-0.4; Publisher: Altium Limited
TP3-TP8 TP14-TP19 = TEST_POINT
U28 U30 = AM26LS32ACD: Quadruple Differential Line Receiver; Note: Inputs have hysteresis (50mV typical).; Published: 15-May-2002; LatestRevisionDate: 13-Apr-2006; LatestRevisionNote: IPC-7351 Footprint Added.; DatasheetVersion: Sep-1986; PackageVersion: Jan-1998; PackageReference: D016; Publisher: Altium Limited; PackageDescription: 16-Pin Small Outline Integrated Circuit 1.27 mm Pitch; Code_IPC: SOIC127P600-16; ComponentLink1Description: Manufacturer Link; ComponentLink1URL: http://www.ti.com/; ComponentLink2Description: Datasheet; ComponentLink2URL: http://www-s.ti.com/sc/ds/am26ls32a.pdf

## Sheet 接口.SchDoc
size A4
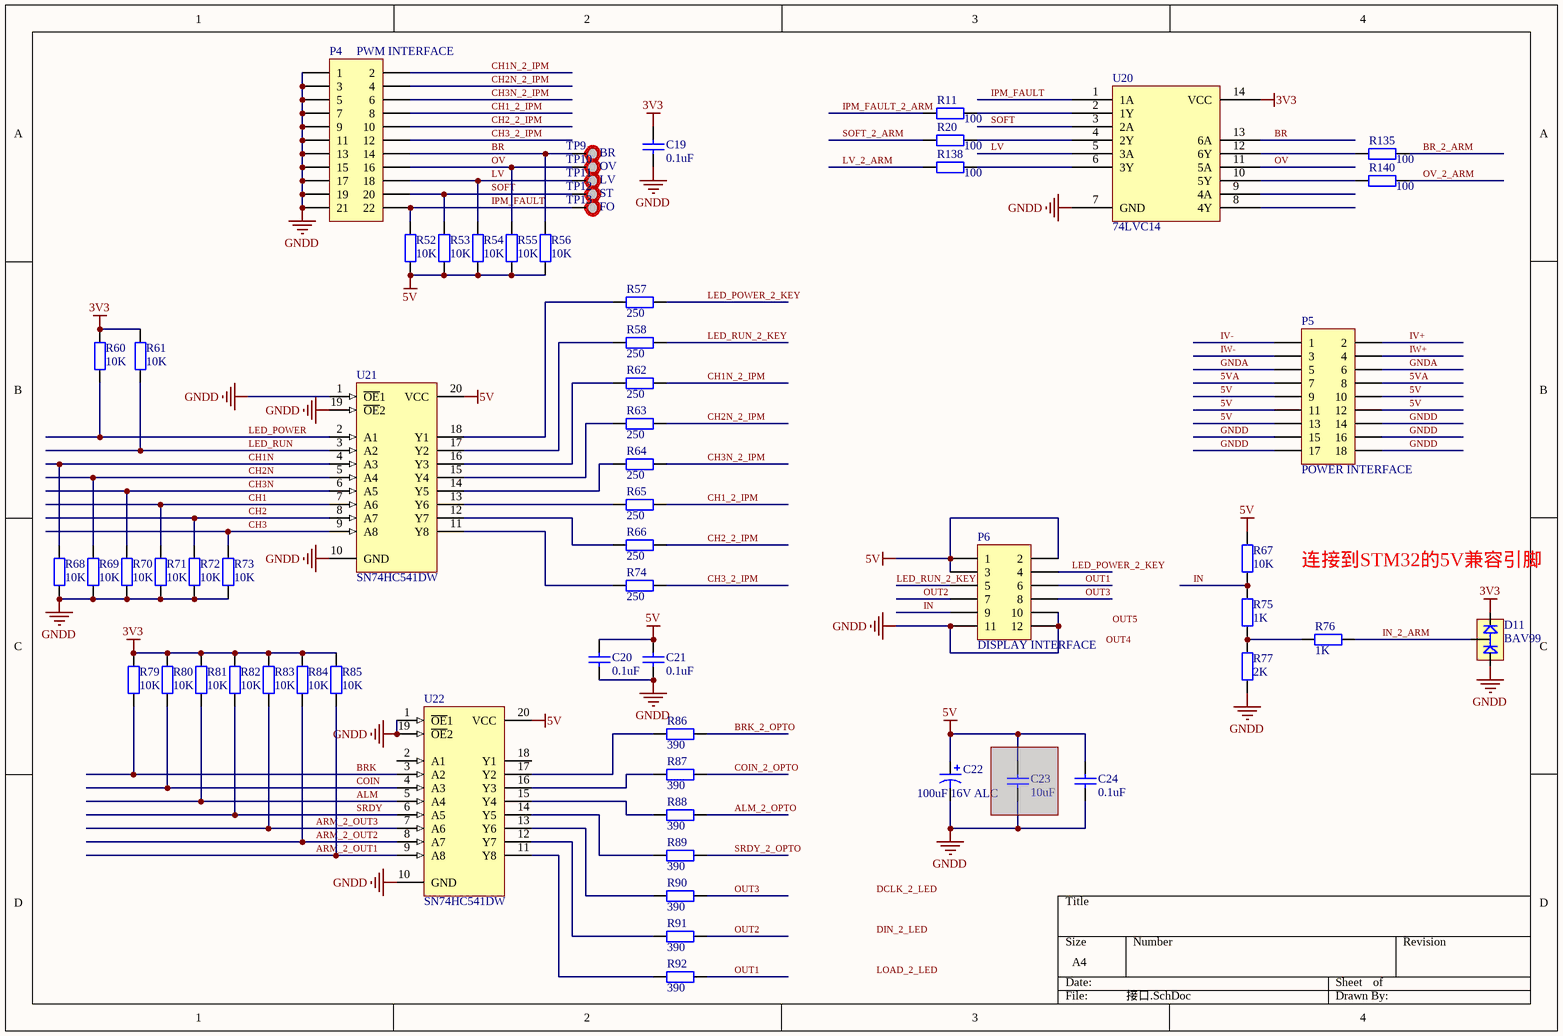
[diagram p5: 接口.SchDoc]

### Parts
(Parts that share a designator on the sheet are numbered #1, #2 ... from top to bottom, then left to right.)
C19  0.1uF  [C SMD 0603]
C20  0.1uF  [C SMD 0603]
C21  0.1uF  [C SMD 0603]
C22  100uF 16V ALC  [D6.3ALC]
C23#1  10uF  [C SMD 1206]  (masked out: inside a compile mask, not in the netlist)
C24  0.1uF  [C SMD 0603]
D11  BAV99  [SOT23]
P4  PWM INTERFACE  [FFC_1.0mm_22pin_弯]
P5  POWER INTERFACE  [FFC_1.0mm_18pin_弯]
P6  DISPLAY INTERFACE  [FFC_1.0mm_12pin_弯]
R11#2  100  [R SMD 0603]
R20#2  100  [R SMD 0603]
R52  10K  [R SMD 0603]
R53  10K  [R SMD 0603]
R54  10K  [R SMD 0603]
R55  10K  [R SMD 0603]
R56  10K  [R SMD 0603]
R57  250  [R SMD 0603]
R58  250  [R SMD 0603]
R60  10K  [R SMD 0603]
R61  10K  [R SMD 0603]
R62  250  [R SMD 0603]
R63  250  [R SMD 0603]
R64  250  [R SMD 0603]
R65  250  [R SMD 0603]
R66  250  [R SMD 0603]
R67  10K  [R SMD 0603]
R68  10K  [R SMD 0603]
R69  10K  [R SMD 0603]
R70  10K  [R SMD 0603]
R71  10K  [R SMD 0603]
R72  10K  [R SMD 0603]
R73  10K  [R SMD 0603]
R74  250  [R SMD 0603]
R75  1K  [R SMD 0603]
R76  1K  [R SMD 0603]
R77  2K  [R SMD 0603]
R79  10K  [R SMD 0603]
R80  10K  [R SMD 0603]
R81  10K  [R SMD 0603]
R82  10K  [R SMD 0603]
R83  10K  [R SMD 0603]
R84  10K  [R SMD 0603]
R85  10K  [R SMD 0603]
R86  390  [R SMD 0603]
R87  390  [R SMD 0603]
R88  390  [R SMD 0603]
R89  390  [R SMD 0603]
R90  390  [R SMD 0603]
R91  390  [R SMD 0603]
R92  390  [R SMD 0603]
R135#2  100  [R SMD 0603]
R138#2  100  [R SMD 0603]
R140#2  100  [R SMD 0603]
TP9  BR  [测点]
TP10  OV  [测点]
TP11  LV  [测点]
TP12  ST  [测点]
TP13  FO  [测点]
U20  74LVC14  [TSSOP14]
U21  SN74HC541DW  [TSSOP20]
U22  SN74HC541DW  [TSSOP20]

### Nets
3V3: C19.1 D11.2 R60.1 R61.1 R79.2 R80.2 R81.2 R82.2 R83.2 R84.2 R85.2 U20.14(VCC)
5V: C20.1 C21.1 C22.1 C24.1 P5.9 P5.10 P5.11 P5.12 P5.13 P6.1 P6.2 P6.3 R52.2 R53.2 R54.2 R55.2 R56.2 R67.1 U21.20(VCC) U22.20(VCC)
5VA: P5.7 P5.8
GNDA: P5.5 P5.6
GNDD: C19.2 C20.2 C21.2 C22.2 C24.2 D11.1 P4.1 P4.3 P4.5 P4.7 P4.9 P4.11 P4.13 P4.15 P4.17 P4.19 P4.21 P5.14 P5.15 P5.16 P5.17 P5.18 P6.10 P6.11 P6.12 R68.2 R69.2 R70.2 R71.2 R72.2 R73.2 R77.1 U20.7(GND) U21.1(~{OE}1) U21.10(GND) U21.19(~{OE}2) U22.1(~{OE}1) U22.10(GND) U22.19(~{OE}2)
ALM: R81.1 U22.5(A4)
ALM_2_OPTO: R88.2
ARM_2_OUT1: R85.1 U22.9(A8)
ARM_2_OUT2: R84.1 U22.8(A7)
ARM_2_OUT3: R83.1 U22.7(A6)
BR: P4.14 R56.1 TP9.1 U20.13(6A)
BR_2_ARM: R135#2.1
BRK: R79.1 U22.3(A2)
BRK_2_OPTO: R86.2
CH1: R71.1 U21.7(A6)
CH1_2_IPM: P4.8 R65.2
CH1N: R68.1 U21.4(A3)
CH1N_2_IPM: P4.2 R62.2
CH2: R72.1 U21.8(A7)
CH2_2_IPM: P4.10 R66.2
CH2N: R69.1 U21.5(A4)
CH2N_2_IPM: P4.4 R63.2
CH3: R73.1 U21.9(A8)
CH3_2_IPM: P4.12 R74.2
CH3N: R70.1 U21.6(A5)
CH3N_2_IPM: P4.6 R64.2
COIN: R80.1 U22.4(A3)
COIN_2_OPTO: R87.2
IN: P6.9 R67.2 R75.1
IN_2_ARM: D11.3 R76.1
IPM_FAULT: P4.22 R52.1 TP13.1 U20.1(1A)
IPM_FAULT_2_ARM: R11#2.2
IV+: P5.2
IV-: P5.1
IW+: P5.4
IW-: P5.3
LED_POWER: R60.2 U21.2(A1)
LED_POWER_2_KEY: P6.4 R57.2
LED_RUN: R61.2 U21.3(A2)
LED_RUN_2_KEY: P6.5 R58.2
LV: P4.18 R54.1 TP11.1 U20.5(3A)
LV_2_ARM: R138#2.2
OUT1: P6.6 R92.2
OUT2: P6.7 R91.2
OUT3: P6.8 R90.2
OV: P4.16 R55.1 TP10.1 U20.11(5A)
OV_2_ARM: R140#2.1
SOFT: P4.20 R53.1 TP12.1 U20.3(2A)
SOFT_2_ARM: R20#2.2
SRDY: R82.1 U22.6(A5)
SRDY_2_OPTO: R89.2
NetR11#2_1: R11#2.1 U20.2(1Y)
NetR20#2_1: R20#2.1 U20.4(2Y)
NetR57_1: R57.1 U21.18(Y1)
NetR58_1: R58.1 U21.17(Y2)
NetR62_1: R62.1 U21.16(Y3)
NetR63_1: R63.1 U21.15(Y4)
NetR64_1: R64.1 U21.14(Y5)
NetR65_1: R65.1 U21.13(Y6)
NetR66_1: R66.1 U21.12(Y7)
NetR74_1: R74.1 U21.11(Y8)
NetR75_2: R75.2 R76.2 R77.2
NetR86_1: R86.1 U22.17(Y2)
NetR87_1: R87.1 U22.16(Y3)
NetR88_1: R88.1 U22.15(Y4)
NetR89_1: R89.1 U22.14(Y5)
NetR90_1: R90.1 U22.13(Y6)
NetR91_1: R91.1 U22.12(Y7)
NetR92_1: R92.1 U22.11(Y8)
NetR135#2_2: R135#2.2 U20.12(6Y)
NetR138#2_1: R138#2.1 U20.6(3Y)
NetR140#2_2: R140#2.2 U20.10(5Y)

Not connected (* = marked no-connect by the designer): U20 8(4Y) 9(4A); U22 2(A1) 18(Y1)

### Notes on the sheet
- 连接到STM32的5V兼容引脚
- Labels drawn without touching a wire or pin: DCLK_2_LED, DIN_2_LED, LOAD_2_LED, OUT4, OUT5

### Library data of the parts
C19-C21 C24 = Cap: Capacitor; Published: 8-Jun-2000; LatestRevisionDate: 17-Jul-2002; LatestRevisionNote: Re-released for DXP Platform.; PackageReference: RAD-0.3; Publisher: Altium Limited; Value: 0.1uF
  C19: PackageDescription: Radial Cap, Thru-Hole; 2 Leads; 0.3 in Pin Spacing
C22 = Cap Pol1: Polarized Capacitor (Radial); Value: 100uF10VALC; Published: 8-Jun-2000; LatestRevisionDate: 17-Jul-2002; LatestRevisionNote: Re-released for DXP Platform.; PackageReference: RB7.6-15; Publisher: Altium Limited
C23#1 = Cap: Capacitor; Value: 0.1uF; Published: 8-Jun-2000; LatestRevisionDate: 17-Jul-2002; LatestRevisionNote: Re-released for DXP Platform.; PackageReference: RAD-0.3; Publisher: Altium Limited
P4 = Header 11X2: Header, 11-Pin, Dual row; LatestRevisionDate: 17-Jul-2002; LatestRevisionNote: Re-released for DXP Platform.; Publisher: Altium Limited
P5 = Header 9X2: Header, 9-Pin, Dual row; LatestRevisionDate: 17-Jul-2002; LatestRevisionNote: Re-released for DXP Platform.; Publisher: Altium Limited
P6 = Header 6X2: Header, 6-Pin, Dual row; LatestRevisionDate: 17-Jul-2002; LatestRevisionNote: Re-released for DXP Platform.; Publisher: Altium Limited
R11#2 R20#2 R135#2 R138#2 R140#2 = Res2: Resistor; Value: 3K; Published: 8-Jun-2000; LatestRevisionDate: 17-Jul-2002; LatestRevisionNote: Re-released for DXP Platform.; PackageReference: AXIAL-0.4; Publisher: Altium Limited
R52-R58 R60-R66 R68-R74 R79-R92 = Res2: Resistor; Value: 5K; Published: 8-Jun-2000; LatestRevisionDate: 17-Jul-2002; LatestRevisionNote: Re-released for DXP Platform.; PackageReference: AXIAL-0.4; Publisher: Altium Limited
R67 R75-R77 = Res2: Resistor; Value: Rx; Published: 8-Jun-2000; LatestRevisionDate: 17-Jul-2002; LatestRevisionNote: Re-released for DXP Platform.; PackageReference: AXIAL-0.4; Publisher: Altium Limited
TP9-TP13 = TEST_POINT
U21 U22 = SN74HC541DW: Octal Buffer/Driver with 3-State Outputs; Published: 8-Jun-2000; LatestRevisionDate: 13-Apr-2006; LatestRevisionNote: IPC-7351 Footprint Added.; DatasheetVersion: May-1997; PackageVersion: Mar-2000; PackageReference: DW020; Publisher: Altium Limited; PackageDescription: 20-Pin Plastic Small Outline Integrated Circuit 1.27 mm Pitch; Code_JEDEC: MS-013; Code_IPC: SOIC127P1030-20; ComponentLink1Description: Manufacturer Link; ComponentLink1URL: http://www.ti.com/; ComponentLink2Description: Datasheet; ComponentLink2URL: http://www-s.ti.com/sc/ds/sn74hc541.pdf

## Sheet 电源.SchDoc
size A4
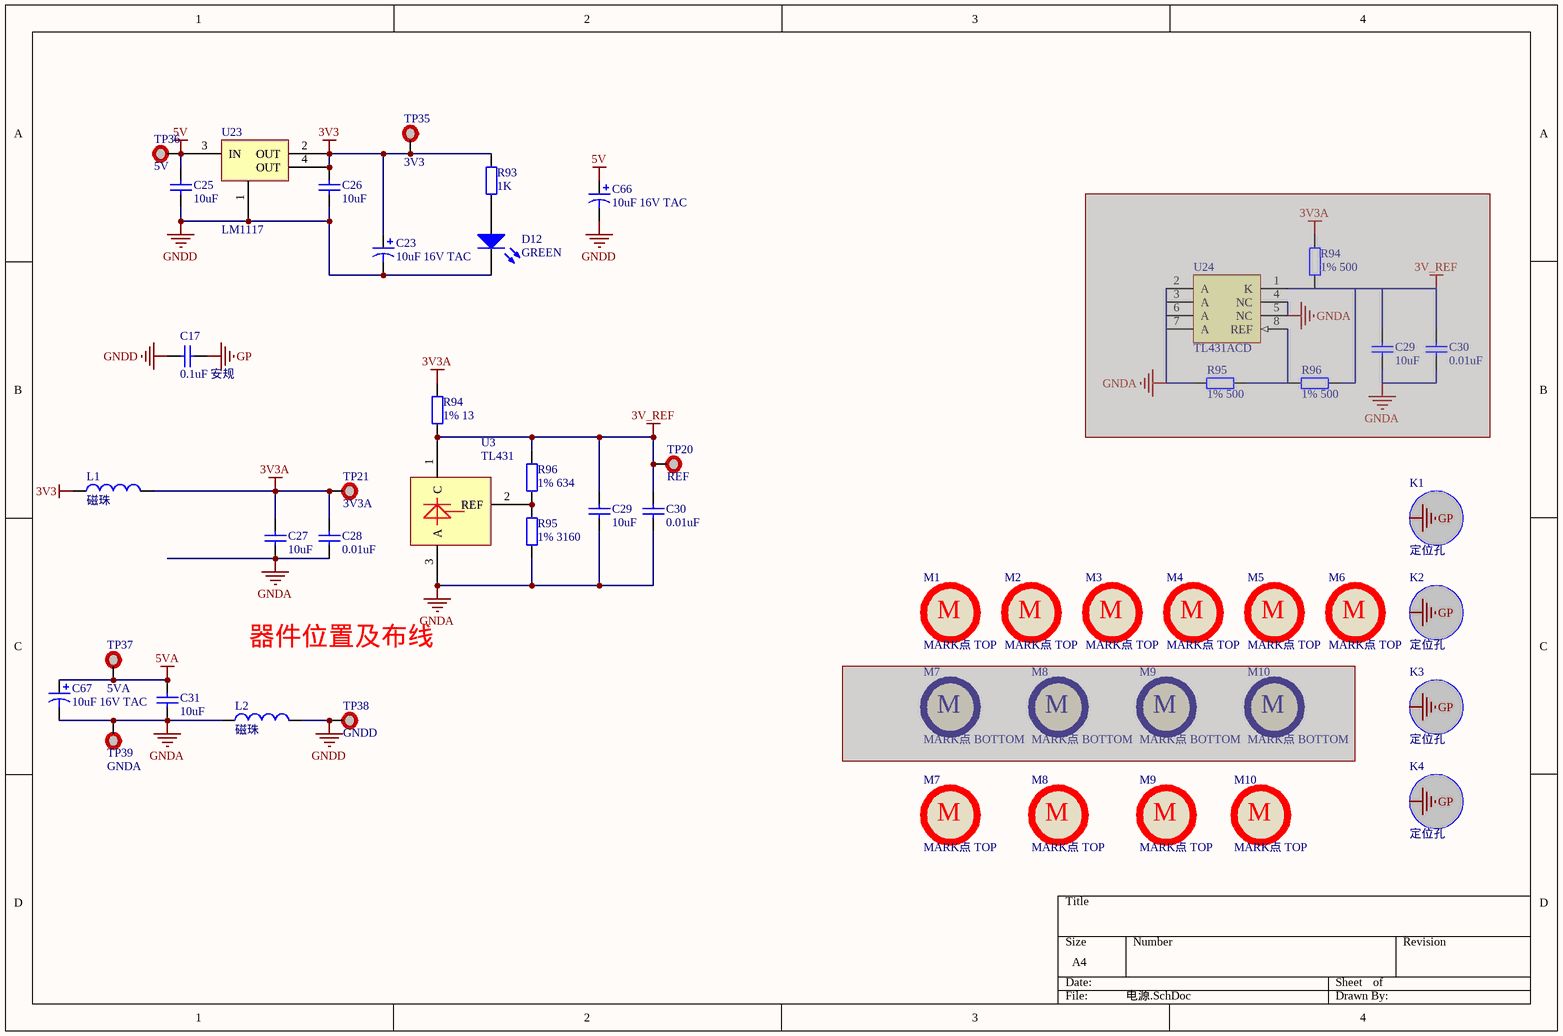
[diagram p6: 电源.SchDoc]

### Parts
(Parts that share a designator on the sheet are numbered #1, #2 ... from top to bottom, then left to right.)
C17#2  0.1uF 安规  [安规电容 10mm间距]
C23#2  10uF 16V TAC  [3216TAC]
C25  10uF  [C SMD 1206]
C26  10uF  [C SMD 1206]
C27  10uF  [C SMD 1206]
C28  0.01uF  [C SMD 0603]
C29#1  10uF  [C SMD 1206]  (masked out: inside a compile mask, not in the netlist)
C29#2  10uF  [C SMD 1206]
C30#1  0.01uF  [C SMD 0603]  (masked out: inside a compile mask, not in the netlist)
C30#2  0.01uF  [C SMD 0603]
C31  10uF  [C SMD 1206]
C66  10uF 16V TAC  [3216TAC]
C67  10uF 16V TAC  [3216TAC]
D12  GREEN  [LED SMD 0805]
K1  定位孔  [定位孔]
K2  定位孔  [定位孔]
K3  定位孔  [定位孔]
K4  定位孔  [定位孔]
L1  磁珠  [L SMD 1206]
L2  磁珠  [L SMD 1206]
M1  MARK点 TOP  [MARK点 TOP]
M2  MARK点 TOP  [MARK点 TOP]
M3  MARK点 TOP  [MARK点 TOP]
M4  MARK点 TOP  [MARK点 TOP]
M5  MARK点 TOP  [MARK点 TOP]
M6  MARK点 TOP  [MARK点 TOP]
M7#1  MARK点 BOTTOM  [MARK点 BOTTOM]  (masked out: inside a compile mask, not in the netlist)
M7#2  MARK点 TOP  [MARK点 TOP]
M8#1  MARK点 BOTTOM  [MARK点 BOTTOM]  (masked out: inside a compile mask, not in the netlist)
M8#2  MARK点 TOP  [MARK点 TOP]
M9#1  MARK点 BOTTOM  [MARK点 BOTTOM]  (masked out: inside a compile mask, not in the netlist)
M9#2  MARK点 TOP  [MARK点 TOP]
M10#1  MARK点 BOTTOM  [MARK点 BOTTOM]  (masked out: inside a compile mask, not in the netlist)
M10#2  MARK点 TOP  [MARK点 TOP]
R93  1K  [R SMD 0603]
R94#1  1% 500  [R SMD 0603]  (masked out: inside a compile mask, not in the netlist)
R94#2  1% 13  [R SMD 0603 1%]
R95#1  1% 500  [R SMD 0603]  (masked out: inside a compile mask, not in the netlist)
R95#2  1% 3160  [R SMD 0603 1%]
R96#1  1% 500  [R SMD 0603]  (masked out: inside a compile mask, not in the netlist)
R96#2  1% 634  [R SMD 0603 1%]
TP20  REF  [测点]
TP21  3V3A  [测点]
TP35  3V3  [测点]
TP36  5V  [测点]
TP37  5VA  [测点]
TP38  GNDD  [测点 地]
TP39  GNDA  [测点 地]
U3#2  TL431  [SOT23]
U23  LM1117
U24  TL431ACD  [NSO8_N]  (masked out: inside a compile mask, not in the netlist)

### Nets
3V3: C23#2.1 C26.2 L1.1 R93.1 TP35.1 U23.2(OUT) U23.4(OUT)
3V3A: C27.2 C28.2 L1.2 R94#2.1 TP21.1
3V_REF: C29#2.2 C30#2.2 R94#2.2 R96#2.1 TP20.1 U3#2.1(C)
5V: C25.2 C66.1 TP36.1 U23.3(IN)
5VA: C31.2 C67.1 TP37.1
GNDA: C27.1 C28.1 C29#2.1 C30#2.1 C31.1 C67.2 L2.1 R95#2.1 TP39.1 U3#2.3(A)
GNDD: C17#2.2 C23#2.2 C25.1 C26.1 C66.2 D12.2(K) L2.2 TP38.1 U23.1(GND)
GP: C17#2.1 K1.1 K2.1 K3.1 K4.1
NetD12_1: D12.1(A) R93.2
NetR95#2_2: R95#2.2 R96#2.2 U3#2.2(REF)

Not connected (* = marked no-connect by the designer): M1 1; M2 1; M3 1; M4 1; M5 1; M6 1; M7#2 1; M8#2 1; M9#2 1; M10#2 1

### Notes on the sheet
- 器件位置及布线
- (in symbol MARK点 BOTTO) M
- (in symbol MARK点 TO) M

### Library data of the parts
C17#2 = Cap: Capacitor; Published: 8-Jun-2000; LatestRevisionDate: 17-Jul-2002; LatestRevisionNote: Re-released for DXP Platform.; PackageReference: RAD-0.3; Publisher: Altium Limited; PackageDescription: Radial Cap, Thru-Hole; 2 Leads; 0.3 in Pin Spacing; Value: 0.1uF
C23#2 C66 C67 = Cap Pol1: as C22 on sheet 接口; Published: 8-Jun-2000; LatestRevisionDate: 17-Jul-2002; LatestRevisionNote: Re-released for DXP Platform.; PackageReference: RB7.6-15; Publisher: Altium Limited
C25-C28 C29#1 C29#2 C30#1 C30#2 C31 = Cap: Capacitor; Value: 0.1uF; Published: 8-Jun-2000; LatestRevisionDate: 17-Jul-2002; LatestRevisionNote: Re-released for DXP Platform.; PackageReference: RAD-0.3; Publisher: Altium Limited; PackageDescription: Radial Cap, Thru-Hole; 2 Leads; 0.3 in Pin Spacing
D12 = LED1: Typical RED GaAs LED; Published: 8-Jun-2000; LatestRevisionDate: 08-Jul-2005; LatestRevisionNote: Mech Layer 1 removed.; PackageReference: LED-1; Publisher: Altium Limited; PackageDescription: LED; 2 Leads
L1 L2 = Inductor: Code_IEC: 1005; Value: 10mH; Published: 8-Jun-2000; LatestRevisionDate: 29-May-2009; LatestRevisionNote: IPC-7351 Footprint Added.; PackageReference: 0402-A; Publisher: Altium Limited; PackageDescription: Chip Inductor; Code_JEITA: 0402
M1-M6 M7#2 M8#2 M9#2 M10#2 = MARK点 TO
M7#1 M8#1 M9#1 M10#1 = MARK点 BOTTO
R93 = Res2: Resistor; Value: 10K; Published: 8-Jun-2000; LatestRevisionDate: 17-Jul-2002; LatestRevisionNote: Re-released for DXP Platform.; PackageReference: AXIAL-0.4; Publisher: Altium Limited
R94#1 R94#2 R95#1 R95#2 R96#1 R96#2 = Res2: Resistor; Value: Rx; Published: 8-Jun-2000; LatestRevisionDate: 17-Jul-2002; LatestRevisionNote: Re-released for DXP Platform.; PackageReference: AXIAL-0.4; Publisher: Altium Limited
TP20 TP21 TP35-TP39 = TEST_POINT
U24 = TL431ACD: Programmable Voltage Reference; Published: 24-Aug-2001; LatestRevisionDate: 13-Apr-2006; LatestRevisionNote: IPC-7351 Footprint Added.; DatasheetVersion: Nov-1998; PackageVersion: Dec-2002; PackageReference: SO8; Publisher: Altium Limited; PackageDescription: 8-Pin Small Outline Integrated Circuit 1.27 mm Pitch; Code_JEDEC: MS-012-AA; Code_IPC: SOIC127P600-8; ComponentLink1Description: Manufacturer Link; ComponentLink1URL: http://www.st.com/; ComponentLink2Description: Datasheet; ComponentLink2URL: http://www.st.com/stonline/products/literature/ds/4467/tl431.pdf

## Nets that join several sheets
3V3: MCU (24 pins), 指令 (10 pins), 编码器 (C51.1 U29.14), 接口 (12 pins), 电源 (7 pins)
3V3A: MCU (U1.22), 电源 (5 pins)
3V_REF: MCU (U1.21), 调理电路 (C41.2 R111.2), 电源 (6 pins)
5V: 指令 (11 pins), 编码器 (41 pins), 接口 (20 pins), 电源 (C25.2 C66.1 TP36.1 U23.3)
5VA: 调理电路 (C42.2 C43.2 U25.4), 接口 (P5.7 P5.8), 电源 (C31.2 C67.1 TP37.1)
GNDA: MCU (U1.19 U1.20), 调理电路 (10 pins), 指令 (P3.20 P3.33), 接口 (P5.5 P5.6), 电源 (10 pins)
GNDD: MCU (30 pins), 指令 (19 pins), 编码器 (50 pins), 接口 (39 pins), 电源 (9 pins)
GP: 指令 (P3.44 P3.45 P3.46), 编码器 (P7.9 P7.27 P7.28), 电源 (5 pins)
A_2_26LS31: 指令 (U7.9), 编码器 (R163.1)
A_2_ARM: MCU (U1.23), 编码器 (R169.1)
A_TEST_2_ARM: MCU (U1.53), 编码器 (R121.1 R122.2)
ALM: MCU (U1.68), 接口 (R81.1 U22.5)
ALM_2_OPTO: 指令 (U9.2), 接口 (R88.2)
ALRS_2_ARM: MCU (U1.87), 指令 (R39.2 TP28.1 U13.4)
ARM_2_OUT1: MCU (U1.84), 接口 (R85.1 U22.9)
ARM_2_OUT2: MCU (U1.83), 接口 (R84.1 U22.8)
ARM_2_OUT3: MCU (U1.82), 接口 (R83.1 U22.7)
AS: MCU (U1.15), 调理电路 (C35.2 R100.2 TP22.1)
AS+: 调理电路 (R98.1 R101.1), 指令 (P3.32)
AS-: 调理电路 (R101.2 R102.1), 指令 (P3.31)
B_2_26LS31: 指令 (U7.7), 编码器 (R154.1)
B_2_ARM: MCU (U1.24), 编码器 (R159.1)
B_TEST_2_ARM: MCU (U1.52), 编码器 (R119.1 R120.2)
BR_2_ARM: MCU (U1.25), 接口 (R135#2.1)
BRK: MCU (U1.62), 接口 (R79.1 U22.3)
BRK_2_OPTO: 指令 (U11.2), 接口 (R86.2)
CH1: MCU (U1.63), 接口 (R71.1 U21.7)
CH1N: MCU (U1.32), 接口 (R68.1 U21.4)
CH2: MCU (U1.64), 接口 (R72.1 U21.8)
CH2N: MCU (U1.35), 接口 (R69.1 U21.5)
CH3: MCU (U1.65), 接口 (R73.1 U21.9)
CH3N: MCU (U1.36), 接口 (R70.1 U21.6)
CLE/SC1/ZEROSPD_2_ARM: MCU (U1.92), 指令 (R45.2 TP31.1 U16.4)
COIN: MCU (U1.66), 接口 (R80.1 U22.4)
COIN_2_OPTO: 指令 (U10.2), 接口 (R87.2)
FIL_2_ARM: MCU (U1.95), 指令 (R49.2 TP33.1 U18.4)
FSTP_2_ARM: MCU (U1.88), 指令 (R41.2 TP29.1 U14.4)
IN_2_ARM: MCU (U1.85), 接口 (D11.3 R76.1)
INH/SC2_2_ARM: MCU (U1.93), 指令 (R47.2 TP32.1 U17.4)
IPM_FAULT_2_ARM: MCU (U1.31), 接口 (R11#2.2)
IV: MCU (U1.16), 调理电路 (C39.2 R107.2 TP23.1)
IV+: 调理电路 (R108.2 R109.2), 接口 (P5.2)
IV-: 调理电路 (R106.2 R108.1), 接口 (P5.1)
IW: MCU (U1.17), 调理电路 (C45.2 R115.2 TP24.1)
IW+: 调理电路 (R116.2 R117.2), 接口 (P5.4)
IW-: 调理电路 (R114.2 R116.1), 接口 (P5.3)
LED_POWER: MCU (U1.58), 接口 (R60.2 U21.2)
LED_RUN: MCU (U1.57), 接口 (R61.2 U21.3)
LV_2_ARM: MCU (U1.34), 接口 (R138#2.2)
OV_2_ARM: MCU (U1.26), 接口 (R140#2.1)
PULS_2_ARM: MCU (U1.38 U1.40), 指令 (R21.1 TP25.1)
RIL_2_ARM: MCU (U1.96), 指令 (R51.2 TP34.1 U19.4)
RSTP_2_ARM: MCU (U1.91), 指令 (R43.2 TP30.1 U15.4)
SIGN_2_ARM: MCU (U1.42 U1.97), 指令 (R22.1 TP26.1)
SOFT_2_ARM: MCU (U1.33), 接口 (R20#2.2)
SON_2_ARM: MCU (U1.86), 指令 (R37.2 TP27.1 U12.4)
SRDY: MCU (U1.69), 接口 (R82.1 U22.6)
SRDY_2_OPTO: 指令 (U8.2), 接口 (R89.2)
U_2_ARM: MCU (U1.3), 编码器 (R160.2)
U_TEST_2_ARM: MCU (U1.48), 编码器 (R129.2 R130.1)
V_2_ARM: MCU (U1.2), 编码器 (R157.2)
V_TEST_2_ARM: MCU (U1.44), 编码器 (R125.1 R126.2)
W_2_ARM: MCU (U1.1), 编码器 (R152.2)
W_TEST_2_ARM: MCU (U1.46), 编码器 (R127.1 R128.2)
Z_2_26LS31: 指令 (U7.1), 编码器 (R143.1)
Z_2_ARM: MCU (U1.4), 编码器 (R150.1)
Z_2_OC: 指令 (R30.2), 编码器 (R143.2 R150.2 TP3.1 U29.2)
Z_TEST_2_ARM: MCU (U1.51), 编码器 (R123.2 R124.1)